# EasyEDA Pro project 3020包裹款控制板 -0113.eprj, board PCB
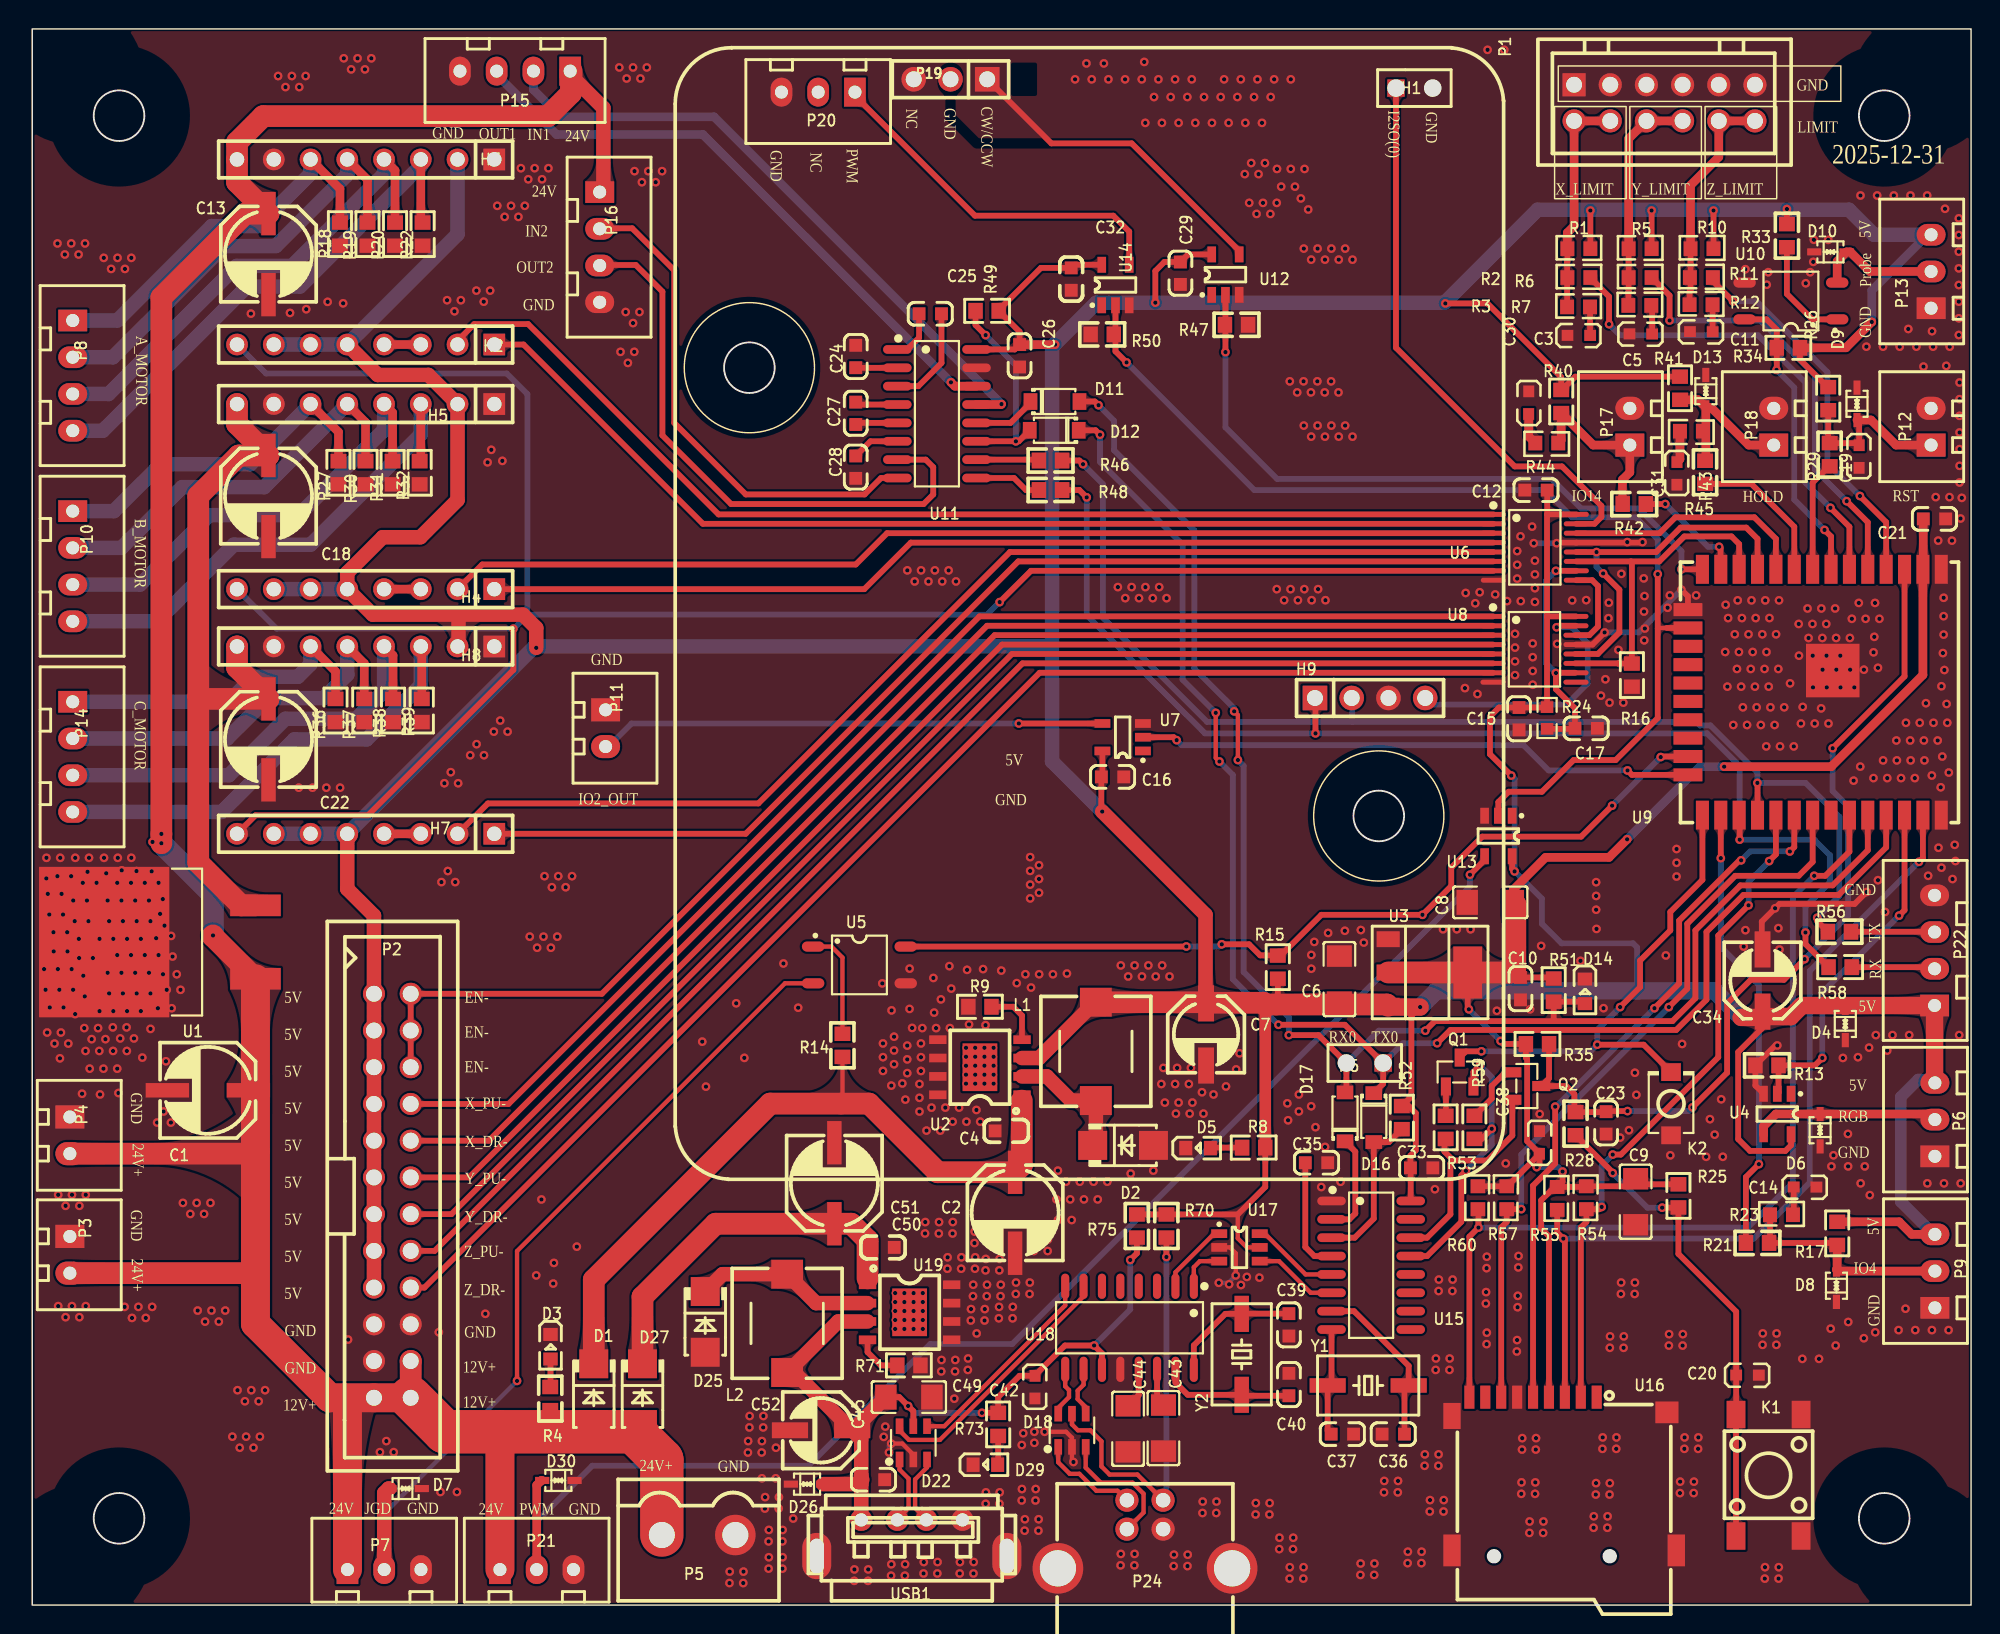
[diagram p2: board, top side]
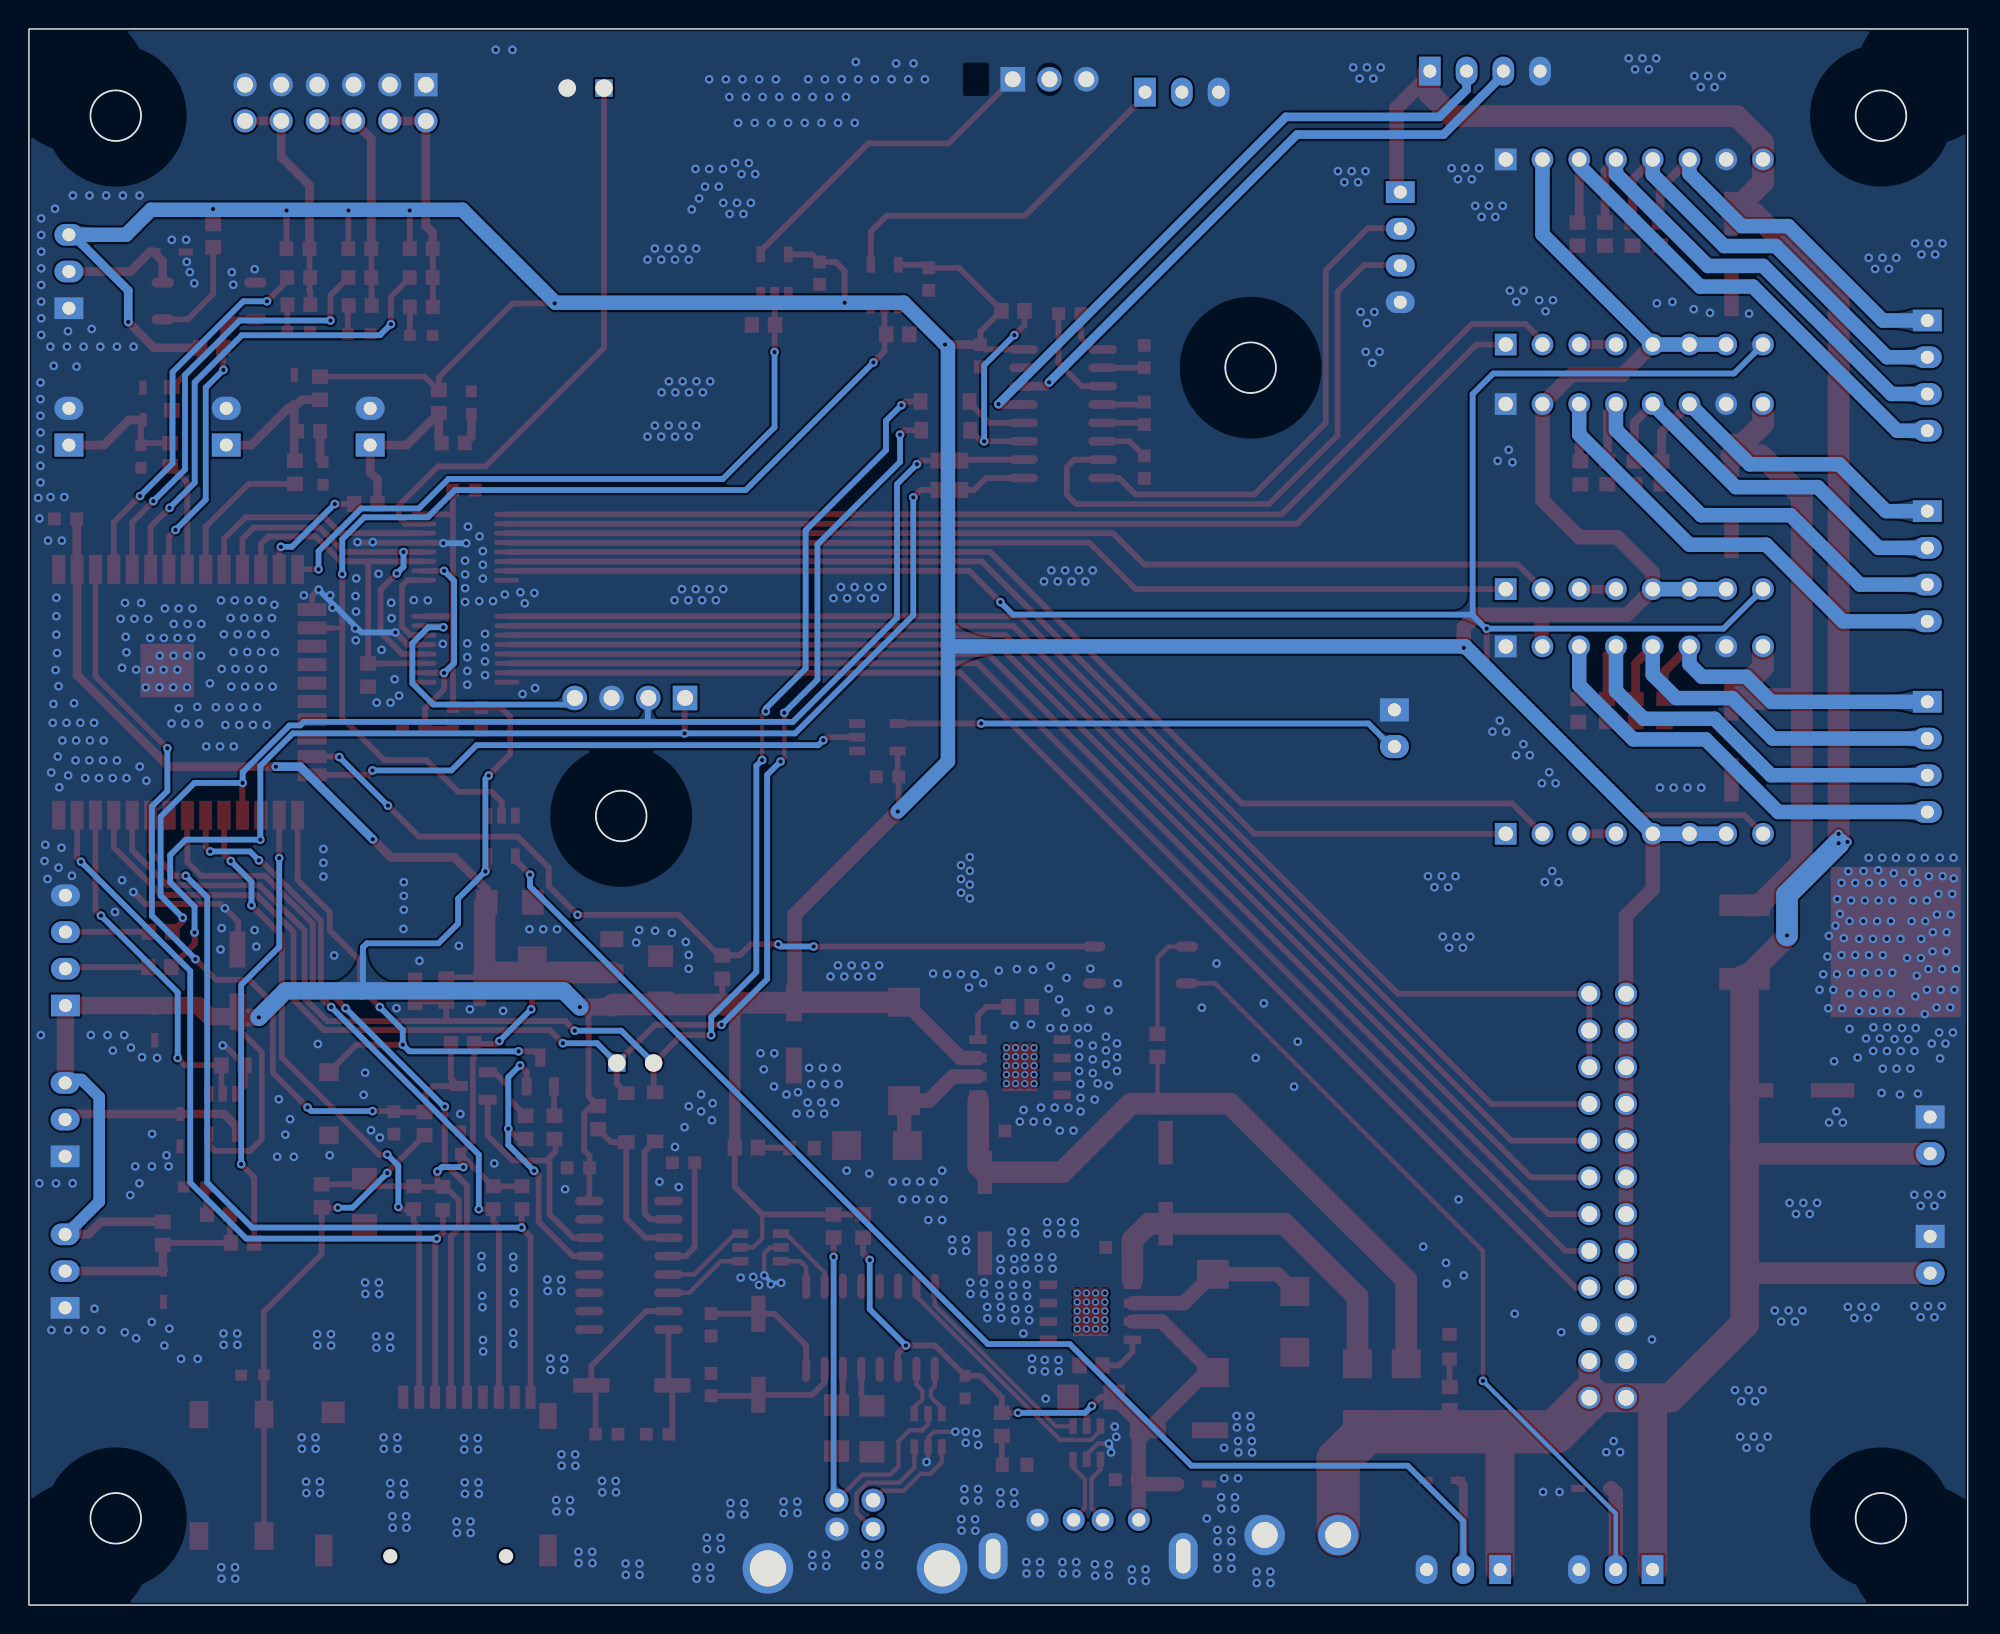
[diagram p3: board, bottom side, seen from below]

Outline 134 x 109 mm; copper layers: Top Layer, Bottom Layer. Coordinates in mm from the lower left corner of the outline.
Outline path: rectangle 0,109 134,0 ; circle c6,103 r1.75 ; circle c6,6 r1.75 ; circle c49.56,85.57 r1.75 ; circle c93.06,54.57 r1.75 ; circle c128,103 r1.75 ; circle c128,6 r1.75
Stack: Top Layer 0.035mm / Dielectric1 1.51mm FR4 er 4.5 / Bottom Layer 0.035mm

## Design rules (mm)
net USB_DP: DP1
net USB_DM: DP1
net DP: DP2
net DM: DP2
net D1-: DP3
net D1+: DP3
template: 用户自定义配置
spacing Default (default): track to track 0.152, other pairs 0 to 0.152
track width Default (default): min 0.254, default 0.254, max 25.4
differential pair differentialPair (default): width min 0.127, default 0.254, max 2.54; gap min 0.152, default 0.152
via Default (default): diameter min 0.25, default 0.61, max 100.025; hole min 0.2, default 0.305, max 59.995

## Placement (name value [footprint] x y rotation side)
C1  100uF/35V  [电解电容贴片6X6]  12.14 35.6 180 top
C2  100uF/35V  [电解电容贴片6X6]  67.93 27.13 270 top
C3  103  [11]  107.63 87.51 0 top
C4  104  [0603C]  67.32 32.79 0 top
C5  103  [11]  111.92 87.61 0 top
C6  10uF  [C1206]  90.34 43.29 90 top
C7  100uF/10V  [CAP-SMD_BD5.0-L5.3-W5.3-RD]  81.13 39.46 90 top
C8  4.7uF  [C1206]  100.77 48.6 0 top
C9  4.7uF  [C1206]  110.82 27.89 90 top
C10  104  [0603C]  102.86 42.63 90 top
C11  103  [11]  116.1 87.76 0 top
C12  104  [0603C]  103.93 77.11 180 top
C13  100uF/35V  [电解电容贴片6X6]  16.33 93.43 270 top
C14  103  [11]  123.27 28.61 0 top
C15  104  [0603C]  102.76 61.3 270 top
C16  104  [0603C]  74.66 57.27 180 top
C17  104  [0603C]  107.4 60.63 180 top
C18  100uF/35V  [电解电容贴片6X6]  16.33 76.7 270 top
C19  103  [11]  125.96 78.69 270 top
C20  103  [11]  119.29 15.61 0 top
C21  104  [0603C]  131.47 75.12 0 top
C22  100uF/35V(47uF/50V)  [电解电容贴片6X6]  16.33 59.87 270 top
C23  104  [0603C]  108.78 33.35 90 top
C24  104  [0603C]  56.92 86.34 270 top
C25  104  [0603C]  62.07 89.3 180 top
C26  104  [0603C]  68.24 86.4 90 top
C27  104  [0603C]  56.92 82.42 90 top
C28  104  [0603C]  56.92 78.69 270 top
C29  104  [0603C]  79.36 92.11 90 top
C30  103  [11]  103.72 83.89 90 top
C31  103  [11]  113.37 77.52 270 top
C32  104  [0603C]  71.81 91.7 90 top
C33  104  [0603C]  96.03 30.24 0 top
C34  100uF/10V  [CAP-SMD_BD5.0-L5.3-W5.3-RD]  119.59 43.19 270 top
C35  104  [0603C]  88.76 30.59 0 top
C36  18pF  [0603C]  94.07 11.82 180 top
C37  18pF  [0603C]  90.55 11.82 0 top
C38  104  [11]  104.47 32.73 90 top
C39  18pF  [0603C]  86.85 19.38 90 top
C40  18pF  [0603C]  86.85 15.25 270 top
C42  103  [11]  69 14.33 270 top
C43  10uF  [C1206]  78.18 12.24 270 top
C44  10uF  [C1206]  75.74 12.19 270 top
C45  18pF  [0603C]  58.14 8.67 180 top
C49  10uF  [C1206]  60.59 14.38 0 top
C50  104  [0603C]  58.8 24.74 180 top
C51  100uF/35V  [电解电容贴片6X6]  55.44 29.17 90 top
C52  100uF/10V  [CAP-SMD_BD5.0-L5.3-W5.3-RD]  54.52 12.09 0 top
D1  SS56  [SMA]  38.81 14.59 270 top
D2  SS34  [SMA]  75.39 31.79 0 top
D3  绿光  [0603LED]  35.8 17.9 90 top
D4  PESD5V0L1BA-N  [SOD-323_L1.8-W1.3-LS2.5-BI]  125.31 40.19 90 top
D5  绿光  [0603LED]  80.54 31.59 180 top
D6  PESD5V0L1BA-N  [SOD-323_L1.8-W1.3-LS2.5-BI]  123.57 32.84 90 top
D7  PESD5V0L1BA-N  [SOD-323_L1.8-W1.3-LS2.5-BI]  25.81 8.06 180 top
D8  PESD5V0L1BA-N  [SOD-323_L1.8-W1.3-LS2.5-BI]  124.7 22.08 90 top
D9  PESD5V0L1BA-N  [SOD-323_L1.8-W1.3-LS2.5-BI]  126.12 83.07 270 top
D10  PESD5V0L1BA-N  [SOD-323_L1.8-W1.3-LS2.5-BI]  124.28 93.58 0 top
D11  1N4148  [SOD-123_L2.8-W1.8-LS3.7-RD]  70.69 83.23 0 top
D12  1N4148  [SOD-123_L2.8-W1.8-LS3.7-RD]  70.64 81.24 180 top
D13  PESD5V0L1BA-N  [SOD-323_L1.8-W1.3-LS2.5-BI]  115.67 83.95 270 top
D14  绿光  [0603LED]  107.3 42.48 90 top
D16  1N4148  [SOD-123_L2.8-W1.8-LS3.7-RD]  92.72 33.71 270 top
D17  1N4148  [SOD-123_L2.8-W1.8-LS3.7-RD]  90.73 33.76 90 top
D18  USBLC6-2SC6  [SOT-23-6_L2.9-W1.6-P0.95-LS2.8-BL]  71.86 12.09 0 top
D22  USBLC6-2SC6  [SOT-23-6_L2.9-W1.6-P0.95-LS2.8-BL]  60.9 11.22 0 top
D25  SS34  [SMA]  46.51 19.58 270 top
D26  PESD5V0L1BA-N  [SOD-323_L1.8-W1.3-LS2.5-BI]  53.55 8.36 0 top
D27  SS56  [SMA]  42.18 14.59 270 top
D29  绿光  [0603LED]  65.84 9.69 180 top
D30  PESD5V0L1BA-N  [SOD-323_L1.8-W1.3-LS2.5-BI]  36.36 8.62 180 top
H1  PZ254  [HDR-TH_2P-P2.54-V-M]  95.52 104.91 0 top
H2  PZ254V-11-08P  [HDR-TH_8P-P2.54-V-M]  23.04 87.17 180 top
H3  PZ254V-11-08P  [HDR-TH_8P-P2.54-V-M]  23.04 99.97 180 top
H4  PZ254V-11-08P  [HDR-TH_8P-P2.54-V-M]  23.04 70.26 180 top
H5  PZ254V-11-08P  [HDR-TH_8P-P2.54-V-M]  23.04 83.06 180 top
H6  PZ254V-11-02P  [HDR-TH_2P-P2.54-V-M]  92.1 37.49 180 top
H7  PZ254V-11-08P  [HDR-TH_8P-P2.54-V-M]  23.04 53.34 180 top
H8  PZ254V-11-08P  [HDR-TH_8P-P2.54-V-M]  23.04 66.3 180 top
H9  PZ254V-11-04P  [HDR-TH_4P-P2.54-V-M]  92.46 62.73 0 top
K1  SW_6X6_H=12.0MM  [KEY-SMD_4P-L6.0-W6.0-P4.50-LS9.0]  120 8.98 270 top
K2  TS-1088  [SW-SMD_L3.9-W3.0-P4.45]  113.26 34.67 90 top
L1  68uH  [IND-SMD_L7.0-W7.0_SMDRI74-330MT]  73.51 38.29 270 top
L2  68uH  [IND-SMD_L7.0-W7.0_SMDRI74-330MT]  52.17 19.48 90 top
P1  XHD2.54-2x6A  [CONN-TH_12P-P2.50_HC-XHD2.54-2X6A]  112.81 103.89 180 top
P2  XHD2.54-2*12  [IDC-TH_24P-P2.54-V-R2-C12-S2.54]  24.89 28.31 270 top
P3  2P  [HDR1X2_CON]  2.6 24.23 270 top
P4  2P  [HDR1X2_CON]  2.6 32.49 270 top
P5  KF2EDGVC-5.08-2P  [CONN-TH_P5.08_KF2EDGVC-5.08-2P]  46.05 4.85 0 top
P6  3P  [HDR1X3_CON]  131.5 33.57 90 top
P7  3P  [HDR1X3_CON]  24.33 2.46 0 top
P8  4P  [HDR1X4_CON]  2.8 88.84 270 top
P9  3P  [HDR1X3_CON]  131.5 23.1 90 top
P10  4P  [HDR1X4_CON]  2.8 75.65 270 top
P11  2P  [HDR1X2_CON]  39.63 60.64 270 top
P12  2P  [HDR1X2_CON]  131.24 81.49 90 top
P13  3P  [HDR1X3_CON]  131.24 92.23 90 top
P14  4P  [HDR1X4_CON]  2.8 62.47 270 top
P15  4P  [HDR1X4_CON]  37.18 106.08 180 top
P16  4P  [HDR1X4_CON]  39.22 97.72 270 top
P17  2P  [HDR1X2_CON]  110.42 81.49 90 top
P18  2P  [HDR1X2_CON]  120.36 81.49 90 top
P19  PZ254V-11-03P  [HDR-TH_3P-P2.54-V-M]  63.47 105.52 180 top
P20  3P  [HDR1X3_CON]  54.32 104.63 180 top
P21  3P  [HDR1X3_CON]  34.87 2.46 0 top
P22  4P  [HDR1X4_CON]  131.48 41.46 90 top
P24  USB-B10-BRW  [USB-B-TH_USB-B10-BRW]  76.91 4.9 0 top
Q1  SS8050  [SOT-23-3_L2.9-W1.3-P1.90-LS2.4-BR]  98.66 36.86 270 top
Q2  SS8050  [SOT-23-3_L2.9-W1.3-P1.90-LS2.4-BR]  103.3 35.89 180 top
R1  51K  [10]  106 93.68 0 top
R2  100  [10]  106 91.69 0 top
R3  100  [10]  105.98 89.66 0 top
R4  47K  [0603R]  35.8 14.28 270 top
R5  51K  [10]  110.23 93.68 0 top
R6  100  [10]  110.23 91.69 0 top
R7  100  [10]  110.21 89.76 0 top
R8  10K  [0603R]  84.42 31.64 0 top
R9  10K  [0603R]  65.5 41.38 180 top
R10  51K  [10]  114.51 93.68 0 top
R11  100  [10]  114.47 91.69 0 top
R12  100  [10]  114.45 89.81 0 top
R13  10K  [0603R]  119.9 37.33 180 top
R14  22K  [0603R]  56 38.71 90 top
R15  10K  [0603R]  86.09 44.12 90 top
R16  10K  [0603R]  110.56 64.31 270 top
R17  10K  [0603R]  124.75 25.7 270 top
R18  10K  [0603R]  21.27 94.81 270 top
R19  10K  [0603R]  23.17 94.81 270 top
R20  10K  [0603R]  25.08 94.81 270 top
R21  100  [0603R]  119.24 25.04 0 top
R22  10K  [0603R]  26.98 94.81 270 top
R23  100  [10]  120 26.88 0 top
R24  10kΩ  [R0603]  104.7 61.35 90 top
R25  10K  [0603R]  113.77 28.3 270 top
R26  10K  [0603R]  124.13 83.43 270 top
R27  10K  [0603R]  21.17 78.3 270 top
R28  100  [0603R]  106.66 33.29 270 top
R29  100  [0603R]  124.23 79.55 90 top
R30  10K  [0603R]  23.04 78.3 270 top
R31  10K  [0603R]  24.91 78.3 270 top
R32  10K  [0603R]  26.78 78.3 270 top
R33  1K  [0603R]  121.27 94.7 270 top
R34  10K  [0603R]  121.37 86.95 180 top
R35  10K  [0603R]  104.03 38.8 0 top
R36  10K  [0603R]  20.96 61.86 270 top
R37  10K  [0603R]  22.95 61.86 270 top
R38  10K  [0603R]  24.94 61.86 270 top
R39  10K  [0603R]  26.92 61.86 270 top
R40  10K  [0603R]  105.67 83.23 270 top
R41  10K  [0603R]  113.88 84.15 270 top
R42  100  [0603R]  110.72 76.14 180 top
R43  100  [0603R]  115.62 78.34 90 top
R44  100  [10]  105.57 80.48 180 top
R45  100  [10]  115.57 81.3 180 top
R46  0Ω  [0603R]  70.38 79.15 0 top
R47  100  [0603R]  83.23 88.54 0 top
R48  0Ω  [0603R]  70.38 77.11 0 top
R49  10K  [0603R]  66 89.51 180 top
R50  10K  [0603R]  73.95 87.87 180 top
R51  10K  [0603R]  105.16 42.53 90 top
R52  10K  [0603R]  94.66 33.71 270 top
R53  10K  [0603R]  97.69 33.04 90 top
R54  10K  [10]  107.53 27.28 90 top
R55  10K  [10]  105.51 27.23 90 top
R56  100Ω  [0603R]  124.9 46.56 0 top
R57  10K  [10]  102.02 27.28 90 top
R58  100Ω  [0603R]  124.95 44.12 0 top
R59  10K  [0603R]  99.68 33.04 90 top
R60  10K  [10]  100.03 27.28 90 top
R70  0Ω  [0603R]  78.39 26.21 90 top
R71  10K  [0603R]  60.59 16.58 0 top
R73  10K  [0603R]  66.76 12.5 90 top
R75  0Ω  [0603R]  76.35 26.21 90 top
U1  CJ7812  [TO-263-2_L10.1-W9.1-P5.08-LS15.2-TL]  10.2 45.85 180 top
U2  XL1509-5.0E1//SXL1509-5.0E1  [ESOP-8_L4.9-W3.9-P1.27-LS6.0-BL-EP]  65.5 37.2 90 top
U3  1117-3.3  [SOT-223]  96.41 43.75 270 top
U4  74LVC1G17  [SOT-23-5]  120.61 33.96 270 top
U5  LTV-357T-C  [SOP-4_L4.4-W3.9-P2.54-LS7.0-TL]  57.17 44.27 0 top
U6  74AHCT595T16-13  [TSSOP-16_L5.0-W4.4-P0.65-LS6.4-BL]  103.85 73.15 270 top
U7  74LVC1G17  [SOT-23-5]  75.37 60.02 180 top
U8  74AHCT595T16-13  [TSSOP-16_L5.0-W4.4-P0.65-LS6.4-BL]  103.83 66.1 270 top
U9  ESP32-WROOM-32  [WIFI-SMD_ESP32-WROOM-32UE-A]  123.19 63.13 270 top
U10  LTV-357T-C  [SOP-4_L4.4-W3.9-P2.54-LS7.0-TL]  121.55 90.19 180 top
U11  SP3232EEN-L/TR  [SOIC-16_L9.9-W3.9-P1.27-LS6.0-BL]  62.53 82.39 270 top
U12  74LVC1G17  [SOT-23-5]  82.47 92.01 90 top
U13  74LVC1G17  [SOT-23-5]  101.33 53.19 270 top
U14  74LVC1G17  [SOT-23-5]  74.87 91.29 90 top
U15  CH340G  [SOIC-16_L9.9-W3.9-P1.27-LS6.0-BL]  92.54 23.5 270 top
U16  自弹TF卡座TFAA  [SIM-SMD_C9900015645]  105.88 9.08 0 top
U17  USBLC2-2SC6  [SOT-23-6]  83.44 24.74 0 top
U18  SL2.1A  [SOP-16_L10.0-W3.9-P1.27-LS6.0-BL]  75.84 19.18 180 top
U19  XL1509-5.0E1//SXL1509-5.0E1  [ESOP-8_L4.9-W3.9-P1.27-LS6.0-BL-EP]  60.64 20.25 270 top
USB1  U-USBAS04P-F001  [USB-A-TH_USB-M-22]  60.79 4.64 0 top
Y1  12M  [晶振贴片49SSMD]  92.33 15.19 0 top
Y2  12M  [晶振贴片49SSMD]  83.59 17.34 90 top

## Footprints (pads in the part's own frame, mm; a bottom-side part is the same pattern mirrored in y, then rotated)
10
  rect 0.965x1.016 smd: 1(0.101,0.117) 2(1.688,0.117)
11
  rect 0.813x0.762 smd: 1(0.043,0.296) 2(-1.524,0.301)
0603C
  rect 0.889x0.889 smd: 1(-0.774,0) 2(0.774,0)
0603LED
  rect 0.9x1 smd: 1(-0.884,-0.017) 2(0.816,-0.017)
0603R
  rect 1x1.1 smd: 1(-0.8,0) 2(0.8,0)
C1206
  rect 1.485x1.728 smd: 1(-1.593,0) 2(1.593,0)
CAP-SMD_BD5.0-L5.3-W5.3-RD
  rect 2.5x1.1 smd: 1(2.15,0) 2(-2.15,0)
CONN-TH_12P-P2.50_HC-XHD2.54-2X6A
  rect 1.6x1.6 hole 1.1: 1(6.25,-1.25)
  round 1.6 hole 1.1: 2(6.25,1.25) 3(3.75,-1.25) 4(3.75,1.25) 5(1.25,-1.25) 6(1.25,1.25) 7(-1.25,-1.25) 8(-1.25,1.25) 9(-3.75,-1.25) 10(-3.75,1.25) 11(-6.25,-1.25) 12(-6.25,1.25)
CONN-TH_P5.08_KF2EDGVC-5.08-2P
  round 2.8 hole 1.8: 1(-2.54,0) 2(2.54,0)
ESOP-8_L4.9-W3.9-P1.27-LS6.0-BL-EP
  rect 0.6x1.2 smd: 1(-1.905,-2.909) 2(-0.635,-2.909) 3(0.635,-2.909) 4(1.905,-2.909) 5(1.905,2.909) 6(0.635,2.909) 7(-0.635,2.909) 8(-1.905,2.909)
  rect 3.3x2.4 smd: 9(0,0)
HDR1X2_CON
  rect 1.6x2 hole 0.9: 1(-1.27,0)
  oval 1.6x2 hole 0.9: 2(1.27,0)
HDR1X3_CON
  rect 1.5x2 hole 0.9: 1(-2.54,0)
  oval 1.5x2 hole 0.9: 2(0,0) 3(2.54,0)
HDR1X4_CON
  rect 1.5x2 hole 0.9: 1(0,0)
  oval 1.5x2 hole 0.9: 2(2.54,0) 3(5.08,0) 4(7.62,0)
HDR-TH_2P-P2.54-V-M
  rect 1.2x1.2 hole 1.2x0.8: 1(-1.27,0)
  round 1.2 hole 1.2x0.8: 2(1.27,0)
HDR-TH_3P-P2.54-V-M
  rect 1.7x1.7 hole 1.1: 1(-2.54,0)
  round 1.7 hole 1.1: 2(0,0) 3(2.54,0)
HDR-TH_4P-P2.54-V-M
  rect 1.7x1.7 hole 1.1: 1(-3.81,0)
  round 1.7 hole 1.1: 2(-1.27,0) 3(1.27,0) 4(3.81,0)
HDR-TH_8P-P2.54-V-M
  rect 1.5x1.5 hole 1: 1(-8.89,0)
  round 1.5 hole 1: 2(-6.35,0) 3(-3.81,0) 4(-1.27,0) 5(1.27,0) 6(3.81,0) 7(6.35,0) 8(8.89,0)
IDC-TH_24P-P2.54-V-R2-C12-S2.54
  round 1.524 hole 1.1: 1(-13.97,-1.27) 2(-13.97,1.27) 3(-11.43,-1.27) 4(-11.43,1.27) 5(-8.89,-1.27) 6(-8.89,1.27) 7(-6.35,-1.27) 8(-6.35,1.27) 9(-3.81,-1.27) 10(-3.81,1.27) 11(-1.27,-1.27) 12(-1.27,1.27) 13(1.27,-1.27) 14(1.27,1.27) 15(3.81,-1.27) 16(3.81,1.27) 17(6.35,-1.27) 18(6.35,1.27) 19(8.89,-1.27) 20(8.89,1.27) 21(11.43,-1.27) 22(11.43,1.27) 23(13.97,-1.27) 24(13.97,1.27)
IND-SMD_L7.0-W7.0_SMDRI74-330MT
  rect 2x2.2 smd: 1(-3.4,0) 2(3.4,0)
KEY-SMD_4P-L6.0-W6.0-P4.50-LS9.0
  rect 1.9x1.3 smd: 1(-4.2,2.25) 2(4.2,2.25) 3(-4.2,-2.25) 4(4.2,-2.25)
R0603
  rect 0.806x0.864 smd: 1(-0.753,0) 2(0.753,0)
SIM-SMD_C9900015645
  rect 0.7x1.6 smd: 1(2.25,5.3) 2(1.15,5.3) 3(0.05,5.3) 4(-1.05,5.3) 5(-2.15,5.3) 6(-3.25,5.3) 7(-4.35,5.3) 8(-5.45,5.3) 9(-6.55,5.3)
  rect 1.2x1.8 smd: 10(-7.75,4)
  rect 1.6x1.5 smd: 11(7.1,4.25)
  rect 1.2x2.2 smd: 12(-7.75,-5.3) 13(7.75,-5.3)
SMA
  rect 2x2 smd: 1(2.1,0) 2(-2.1,0)
SOD-123_L2.8-W1.8-LS3.7-RD
  rect 0.95x1.15 smd: 1(-1.692,0) 2(1.692,0)
SOD-323_L1.8-W1.3-LS2.5-BI
  rect 0.986x0.49 smd: 1(-1.117,0) 2(1.117,0)
SOIC-16_L9.9-W3.9-P1.27-LS6.0-BL
  oval 0.602x1.971 smd: 1(-4.445,-2.736) 2(-3.175,-2.736) 3(-1.905,-2.736) 4(-0.635,-2.736) 5(0.635,-2.736) 6(1.905,-2.736) 7(3.175,-2.736) 8(4.445,-2.736) 9(4.445,2.736) 10(3.175,2.736) 11(1.905,2.736) 12(0.635,2.736) 13(-0.635,2.736) 14(-1.905,2.736) 15(-3.175,2.736) 16(-4.445,2.736)
SOP-4_L4.4-W3.9-P2.54-LS7.0-TL
  oval 1.55x0.7 smd: 1(-3.2,1.27) 2(-3.2,-1.27) 3(3.2,-1.27) 4(3.2,1.27)
SOP-16_L10.0-W3.9-P1.27-LS6.0-BL
  oval 0.56x1.745 smd: 1(-4.445,-2.873) 2(-3.175,-2.873) 3(-1.905,-2.873) 4(-0.635,-2.873) 5(0.635,-2.873) 6(1.905,-2.873) 7(3.175,-2.873) 8(4.445,-2.873) 9(4.445,2.873) 10(3.175,2.873) 11(1.905,2.873) 12(0.635,2.873) 13(-0.635,2.873) 14(-1.905,2.873) 15(-3.175,2.873) 16(-4.445,2.873)
SOT-23-3_L2.9-W1.3-P1.90-LS2.4-BR
  rect 1.25x0.7 smd: 1(1,-0.95) 2(1,0.95) 3(-1,0)
SOT-23-5
  rect 1.1x0.6 smd: 1(-1.4,0.95) 2(-1.4,0) 3(-1.4,-0.95) 4(1.4,-0.95) 5(1.4,0.95)
SOT-23-6
  rect 1.1x0.6 smd: 1(-1.4,0.95) 2(-1.4,0) 3(-1.4,-0.95) 4(1.4,-0.95) 5(1.4,0) 6(1.4,0.95)
SOT-23-6_L2.9-W1.6-P0.95-LS2.8-BL
  rect 0.532x1.072 smd: 1(-0.95,-1.149) 2(0,-1.149) 3(0.95,-1.149) 4(0.95,1.149) 5(0,1.149) 6(-0.95,1.149)
SOT-223
  rect 1.1x1.6 smd: 1(-2.3,-2.7) 2(0,-2.7) 3(2.3,-2.7)
  rect 3.6x2 smd: 4(0,2.8)
SW-SMD_L3.9-W3.0-P4.45
  rect 1.23x1.36 smd: 1(-2.185,0) 2(2.185,0)
TO-263-2_L10.1-W9.1-P5.08-LS15.2-TL
  rect 3.5x1.5 smd: 1(-5.228,2.54) 3(-5.228,-2.54)
  rect 9x10.4 smd: 2(5.228,0)
TSSOP-16_L5.0-W4.4-P0.65-LS6.4-BL
  oval 0.343x1.732 smd: 1(-2.275,-2.866) 2(-1.625,-2.866) 3(-0.975,-2.866) 4(-0.325,-2.866) 5(0.325,-2.866) 6(0.975,-2.866) 7(1.625,-2.866) 8(2.275,-2.866) 9(2.275,2.866) 10(1.625,2.866) 11(0.975,2.866) 12(0.325,2.866) 13(-0.325,2.866) 14(-0.975,2.866) 15(-1.625,2.866) 16(-2.275,2.866)
USB-A-TH_USB-M-22
  oval 2x3.2 hole 1x2.4: 0(-6.57,-1.25) 0(6.57,-1.25)
  round 1.524 hole 0.914: 1(-3.5,1.25) 2(-1.001,1.25) 3(1.001,1.25) 4(3.5,1.25)
USB-B-TH_USB-B10-BRW
  round 1.6 hole 1: 1(1.25,2.355) 2(-1.25,2.355) 3(-1.25,0.355) 4(1.25,0.355)
  round 3.5 hole 2.5: 5(-6.02,-2.355) 6(6.02,-2.355)
WIFI-SMD_ESP32-WROOM-32UE-A
  rect 2x0.9 smd: 1(-8.5,8.755) 2(-8.5,7.485) 3(-8.5,6.215) 4(-8.5,4.945) 5(-8.5,3.675) 6(-8.5,2.405) 7(-8.5,1.135) 8(-8.5,-0.135) 9(-8.5,-1.405) 10(-8.5,-2.675) 11(-8.5,-3.945) 12(-8.5,-5.215) 13(-8.5,-6.485) 14(-8.5,-7.755) 25(8.5,-7.755) 26(8.5,-6.485) 27(8.5,-5.215) 28(8.5,-3.945) 29(8.5,-2.675) 30(8.5,-1.405) 31(8.5,-0.135) 32(8.5,1.135) 33(8.5,2.405) 34(8.5,3.675) 35(8.5,4.945) 36(8.5,6.215) 37(8.5,7.485) 38(8.5,8.755)
  rect 0.9x2 smd: 15(-5.715,-8.755) 16(-4.445,-8.755) 17(-3.175,-8.755) 18(-1.905,-8.755) 19(-0.635,-8.755) 20(0.635,-8.755) 21(1.905,-8.755) 22(3.175,-8.755) 23(4.445,-8.755) 24(5.715,-8.755)
  rect 3.7x3.7 smd: 39(-1.5,1.255)
晶振贴片49SSMD
  rect 2.5x1 smd: 1(-2.8,0) 2(2.8,0)
电解电容贴片6X6
  rect 3x1 smd: 1(-2.8,0) 2(2.8,0)

## Nets
As in the schematic.

Pads without a net: P19 3; P20 2; U2 9; U4 1; U7 1; U8 9; U9 17 18 19 20 21 22 32; U12 1; U13 1; U14 1; U15 9 10 11 12 15; U16 1 8; U19 9

## Via types
v1: diameter 0.5, hole 0.3, Top Layer to Bottom Layer, 40 vias
v2: diameter 0.6, hole 0.3, Top Layer to Bottom Layer, 1088 vias

## Routing (per net, layer and track width the routed paths; a pad name or vN(x,y) marks a point on that pad's centre or on a via; arc(x,y) is an arc through that point)
3V3: length 110.9
  Top Layer w0.4: 104.17,31.18 101.95,28.96 R57.2 R60.2 ; 104.17,31.18 C38.2 104.17,31.23 103.32,32.08 103.32,37.77 103.23,37.85 R35.1 101.69,38.8 v2(101.48,39.01) ; 104.17,31.18 104.17,30.47 v2(103.98,30.29) ; R25.1 111.2,29.1 C9.2 110.3,28.96 R54.2 107.37,28.92 R55.2 ; 102.86,43.4 105.08,43.4 R51.2 ; v2(105.77,29.98) 105.77,29.29 R55.2 ; R55.2 105.21,28.92 104.29,27.99 104.29,26.05 104.83,25.52 104.83,14.38 ; v2(99.29,41.2) 99.21,41.28 U3.4
  Top Layer w0.6: v2(110.23,52.96) 108.98,51.71 104.59,51.71 102.36,49.48 C8.2 ; 130.7,75.12 130.7,71.65 U9.2 130.67,64.32 124.33,57.98 v2(116.94,57.98)
  Top Layer w1.5: C8.2 102.5,48.46 102.5,44.06 102.18,43.74 ; 102.18,43.75 U3.4 U3.2
  Bottom Layer w0.4: v2(103.98,30.29) 105.46,30.29 v2(105.77,29.98) ; v2(101.48,39.01) v2(99.29,41.2)
  Bottom Layer w0.6: v2(116.94,57.98) 115.25,57.98 v2(110.23,52.96)
5V_2: length 55.3
  Top Layer w0.4: v2(65.64,13.3) R73.2 66.76,14.38 68.23,15.86 C42.2 69.31,15.88 71.38,17.95 v2(73.39,17.95) 73.93,17.41 U18.11 ; C49.1 59.93,14.38 v2(60.54,13.77) 60.9,13.41 D22.5 ; R75.1 76.35,24.33 v2(75.89,23.87)
  Top Layer w1: 57.29,8.6 57.06,8.36 D26.2 ; 57.29,8.6 USB1.1 ; 57.29,8.6 C45.2 ; 57.29,8.6 57.29,11.46 C52.1 ; C52.1 56.7,12.09 C49.1 ; C52.1 52.67,16.08 L2.1 55.7,19.61 U19.3
  Bottom Layer w0.4: v2(65.64,13.3) 61.01,13.3 v2(60.54,13.77) ; v2(75.89,23.87) 75.89,20.45 v2(73.39,17.95)
5V_VCC: length 549
  Top Layer w0.3: 83.32,27.01 83.32,25.36 83.95,24.74 U17.5
  Top Layer w0.4: v2(95.92,41.35) 95.32,40.75 95.32,35.17 R52.1 95.13,34.51 95.63,34.02 95.63,31.46 95.25,31.08 C33.1 95.27,30.22 U15.16 ; R10.2 v2(116.2,96.44) ; C12.1 104.71,75.43 ; 104.71,75.43 104.71,75.43 106.72,75.43 ; 104.71,75.43 104.7,75.42 104.7,68.34 ; v2(102.45,50.74) 102.28,50.91 U13.5 ; 85.97,41.53 86.09,41.65 R15.1 ; U14.5 72.02,92.69 C32.2 69.71,92.47 66.79,89.56 R49.1 68.24,88.06 C26.2 67.9,86.83 U11.16 ; 119.54,40.7 119.54,39.88 117.91,38.24 117.91,32.23 118.72,31.41 121.17,31.41 121.56,31.8 U4.5 ; 104.7,68.34 104.7,62.1 104.67,62.07 101.37,62.07 100.75,61.45 100.75,58.84 v2(102.23,57.37) ; 104.7,68.34 104.73,68.37 U8.16 ; 73.89,54.94 C16.2 73.97,57.35 U7.5 ; R34.1 122.17,86.13 124.08,84.23 R26.1 ; 85.22,31.59 85.22,28.92 83.32,27.01 R70.2 R75.2 ; U12.5 79.88,93.41 C29.2 78.24,92.88 77.62,92.26 v2(77.62,90.07) ; R1.2 v2(107.69,96.44) ; R41.1 106.64,84.95 105.72,84.03 R40.1 105.67,84.92 100.57,90.02 v2(97.67,90.02) ; R33.1 v2(121.27,96.54) ; 111.92,93.8 v2(111.92,96.44)
  Top Layer w0.6: R34.1 125.35,86.95 v2(127.14,88.73) ; R17.1 129.03,26.5 129.9,25.64 P9.3 ; C26.2 v2(70.69,87.17)
  Top Layer w0.8: 85.22,41.39 R8.2
  Top Layer w1: v2(34.83,66.2) 34.83,67.58 33.92,68.49 29.46,68.49 ; H2.5 23.88,85.07 27.38,85.07 H5.2 29.39,76.42 26.83,73.85 24.23,73.85 21.77,71.4 H4.5 23.54,68.49 29.46,68.49 ; H8.2 29.46,66.36 29.46,68.49 ; P2.17 P2.15 P2.13 P2.11 P2.9 P2.7 P2.5 P2.3 P2.1 23.62,47.68 21.77,49.52 H7.5 ; U2.3 69.59,37.83 73.45,41.69 ; 81.13,41.69 C7.1 ; 81.09,41.73 81.09,47.74 v2(73.95,54.88)
  Top Layer w1.2: v2(118.11,40.64) 119.48,40.64 119.54,40.7 121.54,40.7 122.31,41.46 P22.1 131.48,36.14 P6.3 ; 93.81,41.35 v2(95.92,41.35)
  Top Layer w1.5: L1.1 81.23,41.69 81.27,41.65 85.07,41.65 85.28,41.45 85.36,41.53 93.63,41.53 U3.3
  Bottom Layer w0.4: 110.98,42.48 110.92,42.53 110.92,45.49 110.64,45.76 105.69,45.76 104.34,47.12 104.34,48.85 v2(102.45,50.74) 102.45,57.14 v2(102.23,57.37)
  Bottom Layer w0.6: 130.99,94.77 127.14,90.91 v2(127.14,88.73)
  Bottom Layer w0.8: 131.5,25.79 131.25,25.79 129.14,27.9 129.14,35.13 130.35,36.34 131.5,36.34
  Bottom Layer w1: 70.48,66.35 70.48,87.01 73.54,90.07 v2(77.62,90.07) 97.62,90.07 104.04,96.49 125.56,96.49 127.29,94.77 P13.3 ; 70.48,66.35 70.44,66.3 34.74,66.3 H7.5 H7.6 H7.7 ; 70.48,66.35 70.48,58.35 v2(73.95,54.88) ; H2.7 H2.6 H2.5 29.39,94.79 H3.2 ; H4.5 H4.6 H4.7
  Bottom Layer w1.2: v2(118.11,40.64) 116.27,42.48 97.05,42.48 v2(95.92,41.35)
12V: length 210.6
  Top Layer w1: 37.18,105.83 39.47,103.54 39.47,97.75
  Top Layer w1.5: 15.05,22.85 14.94,22.96 P3.2 ; U1.1 12.5,46.24 v2(12.5,46.31) ; P4.2 15.26,31.22 15.43,31.38 ; v2(8.92,52.68) v2(8.92,53.33) 8.92,90.42 14.73,96.23 C13.1 14.15,98.4 H3.8 14.15,101.16 15.96,102.97 35.65,102.97 37.23,104.55 37.23,105.78 ; P2.22 P2.24
  Top Layer w1.6: 37.23,105.78 37.23,106.08
  Top Layer w2: P7.1 21.79,13.91 21.68,14.03 ; P2.24 P2.23 20.55,14.34 15.43,19.46 U1.1 ; 32.3,11.99 32.33,11.96 32.33,2.46
  Top Layer w3: P5.1 43.51,10.04 41.57,11.99 28.51,11.99 P2.24
  Bottom Layer w1.5: v2(12.5,46.31) 12.5,49.11 v2(8.92,52.68)
  vias: v2(8.31,52.78)
12V-SW: length 59.7
  Top Layer w0.3: v2(33.51,15.5) 33.51,24.48 52.03,43 U5.2
  Top Layer w1: D7.2 24.63,8.06 24.33,7.75 P7.2
  Bottom Layer w0.3: v2(33.51,15.5) 24.33,6.32 P7.2
12V_2: length 25.4
  Top Layer w1.5: 57.73,22.59 57.73,25.25 56.61,26.37 C51.1 47.23,26.37 42.18,21.32 D27.2
12V_DIV: length 50.5
  Top Layer w1.5: H8.8 14.15,64.84 C22.1 11.63,62.67 11.47,62.82 ; 11.47,62.82 11.47,76.71 14.27,79.5 C18.1 14.15,81.67 H5.8 ; 11.47,62.82 11.47,51.34 14.43,48.39 U1.3
GND: length 43.2
  Top Layer w0.3: v2(59.37,11.17) 60.13,11.17 60.9,10.4 D22.2 ; v2(69.97,11.99) 71.45,11.99 71.86,11.58 D18.2 71.86,10 v2(71.96,9.89) ; v2(83.18,22.8) 83.18,24.33 82.77,24.74 U17.2
  Top Layer w0.4: v2(113.98,70.22) 114.43,69.77 U9.15 ; U8.13 107.84,66.42 v2(108.67,67.26) ; C34.2 119.54,45.39 119.54,47.27 v2(120.46,48.19) 120.75,48.48 125.95,48.48 v2(126.78,49.31) ; U4.3 119.09,35.92 R13.2 120.47,38.7 v2(120.61,38.7) ; v2(111.29,73.51) 111.26,73.48 105.4,73.48 v2(105.36,73.43)
  Bottom Layer w0.3: v2(83.18,22.8) 82.67,22.29 v2(82.01,22.29) ; v2(59.37,11.17) 59.21,11.02 v2(59.21,10.56)
  Bottom Layer w0.4: v2(108.67,67.26) 111.02,67.26 v2(113.98,70.22) ; v2(105.36,73.43) v2(103.78,73.43)
  vias: v2(0.82,43.98) v2(0.98,51.68) v2(0.97,50.25) v2(0.92,42.55) v2(1.08,49.18) v2(1.03,39.6) v2(1.18,47.76) v2(1.21,41.33) v2(1.47,46.53) v2(1.48,45.21) v2(1.54,38.83) v2(1.74,94.17) v2(1.74,50.41) v2(1.77,43.98) v2(1.8,28.38) v2(1.8,20.67) v2(1.87,42.55) v2(1.91,37.81) v2(1.94,51.68) v2(1.98,39.6) v2(2.03,49.18) v2(2.13,47.76) v2(2.16,41.33) v2(2.25,93.4) v2(2.3,27.61) v2(2.3,19.91) v2(2.42,46.53) v2(2.44,45.21) v2(2.49,38.83) v2(2.7,94.17) v2(2.69,50.41) v2(2.72,43.98) v2(2.75,28.38) v2(2.75,20.67) v2(2.83,48.72) v2(2.83,42.55) v2(2.97,51.68) v2(2.93,47.3) v2(2.97,40.87) v2(3.21,93.4) v2(3.22,46.07) v2(3.24,44.75) v2(3.26,27.61) v2(3.26,19.91) v2(3.5,49.95) v2(3.44,35.36) v2(3.53,43.52) v2(3.6,39.9) v2(3.65,94.17) v2(3.63,42.09) v2(3.68,38.32) v2(3.7,28.38) v2(3.7,20.67) v2(3.78,48.72) v2(3.82,50.71) v2(3.89,47.3) v2(3.92,51.68) v2(3.97,37.1) v2(4.11,39.14) v2(4.19,44.75) v2(4.45,49.95) v2(4.55,39.9) v2(4.65,46.07) v2(4.65,41.07) v2(4.63,38.32) v2(4.69,35.31) v2(4.94,93.17) v2(4.96,51.68) v2(4.92,37.1) v2(5.11,50.61) v2(5.06,39.14) v2(5.21,48.72) v2(5.21,43.73) v2(5.31,47.3) v2(5.31,42.3) v2(5.45,92.4) v2(5.6,46.07) v2(5.6,41.07) v2(5.57,39.95) v2(5.59,38.32) v2(5.9,93.17) v2(5.91,51.68) v2(5.88,49.95) v2(5.88,44.95) v2(5.88,37.1) v2(5.96,35.41) v2(6.08,39.19) v2(6.19,50.81) v2(6.16,48.72) v2(6.16,43.73) v2(6.27,47.3) v2(6.27,42.3) v2(6.41,92.4) v2(6.39,20.62) v2(6.55,46.07) v2(6.55,41.07) v2(6.52,39.95) v2(6.54,38.32) v2(6.85,93.17) v2(6.85,51.68) v2(6.83,49.95) v2(6.83,44.95) v2(6.89,19.86) v2(7.12,48.72) v2(7.12,43.73) v2(7.03,39.19) v2(7.2,50.76) v2(7.22,47.3) v2(7.22,42.3) v2(7.34,20.62) v2(7.51,46.07) v2(7.51,41.07) v2(7.61,37.86) v2(7.78,49.95) v2(7.78,44.95) v2(7.85,19.86) v2(8.07,48.72) v2(8.07,43.73) v2(8.17,47.3) v2(8.17,42.3) v2(8.17,39.85) v2(8.25,50.74) v2(8.29,20.62) v2(8.56,46.12) v2(8.68,41.27) v2(8.63,33.37) v2(8.73,49.95) v2(8.73,44.95) v2(8.84,47.8) v2(9.02,48.82) v2(9.04,43.62) v2(9.08,34.13) v2(9.14,46.99) v2(9.3,42.55) v2(9.24,37.61) v2(9.6,46.28) v2(9.58,33.37) v2(9.7,44.85) v2(9.64,41.27) v2(9.99,43.62) v2(10.25,42.55) v2(10.41,27.81) v2(10.92,27.05) v2(11.37,27.81) v2(11.43,20.37) v2(11.88,27.05) v2(11.94,19.6) v2(12.32,27.81) v2(12.39,20.37) v2(12.9,19.6) v2(13.34,20.37) v2(13.83,11.65) v2(14.19,14.86) v2(14.34,10.88) v2(14.7,14.1) v2(14.78,11.65) v2(15.11,89.31) v2(15.14,14.86) v2(15.29,10.88) v2(15.65,14.1) v2(15.73,11.65) v2(16.09,14.86) v2(16.99,105.74) v2(17.5,104.98) v2(17.82,89.36) v2(17.95,105.74) v2(18.46,104.98) v2(18.42,56.53) v2(18.9,105.74) v2(18.94,89.62) v2(19.37,56.53) v2(20.42,90.13) v2(20.33,56.53) v2(21.28,56.53) v2(21.49,90.02) v2(21.53,106.97) v2(21.83,18.36) v2(22.04,106.2) v2(22.48,106.97) v2(22.99,106.2) v2(23.44,106.97) v2(24.03,10.58) v2(24.47,11.34) v2(24.98,10.58) v2(28.1,18.87) v2(28.21,7.82) v2(28.28,50) v2(28.49,56.83) v2(28.67,90.24) v2(28.72,50.76) v2(28.93,57.6) v2(29.18,89.47) v2(29.23,50) v2(29.35,7.82) v2(29.44,56.83) v2(29.62,90.24) v2(30.27,58.77) v2(30.7,90.9) v2(30.71,59.54) v2(31.21,90.14) v2(31.22,58.77) v2(31.31,20.15) v2(31.47,79.03) v2(31.65,90.9) v2(31.73,79.89) v2(31.9,60.4) v2(32.14,96.77) v2(32.34,61.17) v2(32.49,79.13) v2(32.65,96) v2(32.85,60.4) v2(33.09,96.77) v2(33.6,96) v2(33.77,99.37) v2(34.04,96.77) v2(34.28,98.6) v2(34.38,46.23) v2(34.72,99.37) v2(34.89,45.46) v2(34.83,22.8) v2(35.19,28.05) v2(35.23,98.6) v2(35.4,50.41) v2(35.34,46.23) v2(35.68,99.37) v2(35.91,49.64) v2(35.85,45.46) v2(36.01,22.24) v2(36.06,23.66) v2(36.29,46.23) v2(36.36,50.41) v2(36.87,49.64) v2(37.31,50.41) v2(37.64,24.79) v2(40.57,106.34) v2(40.66,86.67) v2(41.01,89.42) v2(41.08,105.57) v2(41.17,85.9) v2(41.52,106.34) v2(41.52,88.66) v2(41.61,86.67) v2(41.63,99.16) v2(41.97,89.42) v2(42.03,105.57) v2(42.14,98.4) v2(42.48,106.34) v2(42.58,99.16) v2(43.09,98.4) v2(43.53,99.16) v2(46.31,38.96) v2(46.56,35.85) v2(48.21,2.31) v2(48.19,1.52) v2(48.65,41.62) v2(49.22,37.84) v2(49.16,2.31) v2(49.14,1.52) v2(49.48,11.34) v2(49.46,10.55) v2(49.58,13.08) v2(49.57,12.29) v2(50.42,10.55) v2(50.52,12.29) v2(50.43,11.34) v2(50.43,8.77) v2(50.53,13.08) v2(50.65,7.47) v2(50.64,6.67) v2(50.91,5.2) v2(50.89,4.41) v2(50.91,3.31) v2(50.89,2.52) v2(51.4,10.88) v2(51.39,8.77) v2(51.61,7.47) v2(51.59,6.67) v2(51.92,44.37) v2(51.86,5.2) v2(51.85,4.41) v2(51.86,3.31) v2(51.85,2.52) v2(52.59,5.99) v2(52.94,41.31) v2(56.81,1.68) v2(56.82,2.47) v2(57.78,2.47) v2(57.76,1.68) v2(58.75,42.99) v2(58.8,38.84) v2(58.8,37.89) v2(58.8,36.94) v2(58.85,11.63) v2(58.96,12.34) v2(59.39,41.13) v2(59.38,35.92) v2(59.38,2.82) v2(59.36,2.03) v2(59.56,39.31) v2(59.56,38.35) v2(59.56,37.4) v2(60.14,36.07) v2(60.31,2.03) v2(60.34,34.95) v2(60.33,2.82) v2(60.48,71.56) v2(60.47,38.69) v2(60.47,37.74) v2(60.47,36.79) v2(60.64,44.01) v2(60.63,41.23) v2(60.81,39.91) v2(60.99,70.79) v2(61.32,36.03) v2(61.32,35.08) v2(61.32,34.13) v2(61.43,71.56) v2(61.52,39.9) v2(61.42,38.84) v2(61.42,37.89) v2(61.42,36.94) v2(61.62,2.98) v2(61.6,2.19) v2(61.7,25.7) v2(61.81,32.81) v2(61.72,26.49) v2(61.94,70.79) v2(62.15,34.4) v2(62.28,43.37) v2(62.38,71.56) v2(62.33,40.97) v2(62.47,39.9) v2(62.57,2.98) v2(62.55,2.19) v2(62.67,26.49) v2(62.66,25.7) v2(62.8,41.89) v2(62.76,32.81) v2(62.89,70.79) v2(62.84,16.95) v2(62.83,16.16) v2(63.11,34.4) v2(63.27,24.05) v2(63.25,23.26) v2(63.34,71.56) v2(63.39,44.19) v2(63.52,42.63) v2(63.42,39.9) v2(63.61,33.43) v2(63.61,25.7) v2(63.62,26.49) v2(63.79,16.95) v2(63.78,16.16) v2(63.73,14.27) v2(63.85,70.79) v2(64.06,34.4) v2(64.12,2.98) v2(64.1,2.19) v2(64.22,24.05) v2(64.2,23.26) v2(64.61,43.93) v2(64.57,33.43) v2(64.68,17.05) v2(64.66,16.26) v2(64.75,40.16) v2(64.88,20.47) v2(64.87,19.68) v2(65.02,21.36) v2(65.04,22.15) v2(65.07,2.98) v2(65.05,2.19) v2(65.14,25.83) v2(65.12,25.04) v2(65.17,24.05) v2(65.15,23.26) v2(65.26,34.24) v2(65.27,18.79) v2(65.52,33.43) v2(65.72,43.98) v2(65.82,19.68) v2(65.89,40.11) v2(65.9,23.94) v2(65.89,23.15) v2(65.84,20.47) v2(65.91,7.8) v2(65.9,7.01) v2(65.99,22.15) v2(65.97,21.36) v2(66.09,25.83) v2(66.07,25.04) v2(66.8,19.83) v2(66.85,23.94) v2(66.84,23.15) v2(66.82,20.62) v2(66.86,7.8) v2(66.85,7.01) v2(66.97,43.88) v2(66.94,22.15) v2(66.92,21.36) v2(67.77,20.62) v2(67.76,19.83) v2(67.99,22.31) v2(67.98,21.52) v2(68.04,43.01) v2(68.39,11.07) v2(68.4,8.03) v2(68.39,7.24) v2(68.49,11.88) v2(68.61,5.94) v2(68.59,5.14) v2(68.64,43.62) v2(68.97,51.73) v2(68.97,50.77) v2(68.97,49.82) v2(68.97,48.87) v2(68.95,22.31) v2(68.93,21.52) v2(69.03,42.71) v2(69.24,25.28) v2(69.23,24.49) v2(69.26,11.99) v2(69.26,11.22) v2(69.35,8.03) v2(69.34,7.24) v2(69.58,51.16) v2(69.58,50.21) v2(69.58,49.26) v2(69.59,43.62) v2(69.56,5.94) v2(69.54,5.14) v2(70.2,25.28) v2(70.18,24.49) v2(70.54,43.62) v2(70.79,28.06) v2(70.89,30.04) v2(70.89,26.63) v2(71.51,43.68) v2(71.45,29.28) v2(71.74,28.06) v2(71.84,26.63) v2(72.07,105.51) v2(72.4,29.28) v2(72.69,28.06) v2(72.86,106.62) v2(73.23,105.51) v2(73.35,29.28) v2(73.64,28.06) v2(74.07,106.62) v2(74.3,29.28) v2(74.38,105.51) v2(75.03,70.4) v2(75.22,2.75) v2(75.24,44.24) v2(75.24,3.54) v2(75.53,105.51) v2(75.54,69.64) v2(75.75,43.47) v2(75.92,29.84) v2(75.98,70.4) v2(76.19,44.24) v2(76.19,3.54) v2(76.17,2.75) v2(76.49,69.64) v2(76.68,105.51) v2(76.7,43.47) v2(76.85,106.72) v2(76.93,102.5) v2(76.94,70.4) v2(77.14,44.24) v2(77.45,69.64) v2(77.48,30.04) v2(77.53,104.29) v2(77.65,43.47) v2(77.84,105.51) v2(77.89,70.4) v2(78.08,102.5) v2(78.09,44.24) v2(78.04,36.04) v2(78.18,37.15) v2(78.28,34.75) v2(78.4,69.64) v2(78.6,43.47) v2(78.68,104.29) v2(78.91,3.49) v2(78.89,2.7) v2(78.99,105.51) v2(78.99,36.04) v2(79.04,33.99) v2(79.13,37.15) v2(79.23,102.5) v2(79.23,34.75) v2(79.84,104.29) v2(79.86,3.49) v2(79.84,2.7) v2(79.94,36.04) v2(80,33.99) v2(80.08,37.15) v2(80.14,105.51) v2(80.18,34.75) v2(80.38,102.5) v2(80.85,35.46) v2(80.9,7.16) v2(80.88,6.37) v2(80.99,104.29) v2(80.95,33.99) v2(81.54,102.5) v2(81.65,35.31) v2(81.85,7.16) v2(81.83,6.37) v2(82.14,104.29) v2(82.38,105.51) v2(82.49,38.16) v2(82.5,35.87) v2(82.69,102.5) v2(82.72,22.19) v2(83.21,37.05) v2(83.29,104.29) v2(83.44,38.16) v2(83.53,105.51) v2(83.54,22.13) v2(83.8,98.96) v2(83.84,102.5) v2(83.95,22.7) v2(84.11,96.97) v2(84.25,99.73) v2(84.44,104.29) v2(84.62,96.21) v2(84.57,7.06) v2(84.55,6.27) v2(84.68,105.51) v2(84.76,98.96) v2(84.81,22.64) v2(84.99,102.5) v2(85.06,96.97) v2(85.2,99.73) v2(85.5,6.27) v2(85.6,104.29) v2(85.57,96.21) v2(85.52,7.06) v2(85.83,105.51) v2(86.01,96.97) v2(86.01,70.26) v2(86.03,99.32) v2(86.2,4.66) v2(86.19,3.87) v2(86.32,98.09) v2(86.52,69.49) v2(86.75,34.7) v2(86.8,33.53) v2(86.91,84.63) v2(86.91,2.62) v2(86.9,1.83) v2(86.98,105.51) v2(86.98,99.32) v2(86.97,70.26) v2(87.15,4.66) v2(87.14,3.87) v2(87.27,98.09) v2(87.43,83.86) v2(87.48,69.49) v2(87.54,35.31) v2(87.54,34.14) v2(87.68,97.28) v2(87.88,93.81) v2(87.87,84.63) v2(87.88,81.57) v2(87.92,70.26) v2(87.87,2.62) v2(87.85,1.83) v2(87.94,99.32) v2(88.19,96.51) v2(88.39,93.04) v2(88.38,83.86) v2(88.39,80.8) v2(88.4,44.96) v2(88.4,44.01) v2(88.39,34.5) v2(88.43,69.49) v2(88.61,45.86) v2(88.69,33.05) v2(88.82,84.63) v2(88.84,93.81) v2(88.84,81.57) v2(88.87,70.26) v2(89.09,28.91) v2(89.35,93.04) v2(89.33,83.86) v2(89.35,80.8) v2(89.38,69.49) v2(89.35,31.69) v2(89.57,46.48) v2(89.79,93.81) v2(89.77,84.63) v2(89.79,81.57) v2(90.3,93.04) v2(90.28,83.86) v2(90.3,80.8) v2(90.42,29.27) v2(90.74,93.81) v2(90.74,81.57) v2(90.72,46.63) v2(91.25,93.04) v2(91.25,80.8) v2(91.81,2.88) v2(91.79,2.08) v2(91.83,46.68) v2(92.03,45.82) v2(92.76,2.88) v2(92.75,2.08) v2(93.44,8.59) v2(93.43,7.8) v2(94.4,8.59) v2(94.38,7.8) v2(95.07,3.69) v2(95.06,2.9) v2(96.01,2.9) v2(96.03,3.69) v2(96.25,10.42) v2(96.23,9.63) v2(96.61,7.26) v2(96.59,6.47) v2(96.94,28.76) v2(97.01,17.05) v2(97,16.26) v2(97.22,22.51) v2(97.2,21.72) v2(97.2,10.42) v2(97.18,9.63) v2(97.51,46.74) v2(97.56,7.26) v2(97.54,6.47) v2(97.97,17.05) v2(97.95,16.26) v2(98.17,22.51) v2(98.15,21.72) v2(98.46,46.74) v2(99.02,63.41) v2(99.07,69.99) v2(99.41,46.74) v2(99.73,69.28) v2(99.89,63) v2(100.04,70.04) v2(100.52,23.3) v2(100.48,21.64) v2(100.47,20.85) v2(100.52,18.05) v2(100.58,107.55) v2(100.53,24.09) v2(100.53,18.84) v2(101.11,69.89) v2(101.23,41.1) v2(101.74,107.55) v2(101.84,30.54) v2(101.93,69.43) v2(102.48,67.17) v2(102.48,66.21) v2(102.48,65.26) v2(102.48,64.31) v2(102.61,17.54) v2(102.63,72.89) v2(102.63,71.94) v2(102.63,70.99) v2(102.71,23.35) v2(102.67,21.39) v2(102.66,20.6) v2(102.62,18.33) v2(102.73,24.14) v2(102.86,73.91) v2(102.88,69.43) v2(102.91,7.69) v2(102.98,11.55) v2(102.96,10.76) v2(102.93,8.49) v2(103.49,5.78) v2(103.47,4.99) v2(103.52,41.2) v2(103.66,74.58) v2(103.7,66.5) v2(103.7,65.55) v2(103.7,64.6) v2(103.7,63.65) v2(103.85,72.23) v2(103.85,71.28) v2(103.85,70.32) v2(103.85,69.37) v2(103.92,10.76) v2(103.88,8.49) v2(103.87,7.69) v2(103.93,11.55) v2(104.19,33.96) v2(104.29,45.59) v2(104.44,5.78) v2(104.43,4.99) v2(105.39,66.47) v2(106.43,69.48) v2(107.01,44.55) v2(107.4,69.5) v2(107.91,5.35) v2(107.93,6.14) v2(108.09,49.99) v2(108.09,49.04) v2(108.09,48.09) v2(108.11,46.76) v2(108.08,8.43) v2(108.06,7.64) v2(108.42,62.89) v2(108.6,41.28) v2(108.54,11.6) v2(108.52,10.81) v2(108.73,64.02) v2(108.88,6.14) v2(108.86,5.35) v2(108.96,69.32) v2(108.94,68.25) v2(109.01,62.41) v2(109.02,7.64) v2(109.05,18.58) v2(109.03,17.79) v2(109.03,8.43) v2(109.49,11.6) v2(109.47,10.81) v2(109.63,66.06) v2(109.75,32.33) v2(109.81,22.31) v2(109.8,21.52) v2(109.83,71.32) v2(109.97,62.41) v2(110,18.58) v2(109.98,17.79) v2(110.24,73.51) v2(110.36,32.84) v2(110.77,36.82) v2(110.77,22.31) v2(110.75,21.52) v2(110.87,35.29) v2(111.38,71) v2(111.4,68.71) v2(111.41,66.72) v2(111.43,69.78) v2(111.45,67.54) v2(112.91,44.92) v2(113.03,68.97) v2(113.11,17.95) v2(113.18,69.83) v2(113.21,31.1) v2(113.13,18.74) v2(113.65,52.29) v2(113.65,51.33) v2(113.65,50.38) v2(113.89,8.54) v2(113.88,7.75) v2(114.03,38.8) v2(114.08,18.74) v2(114.07,17.95) v2(114.2,11.6) v2(114.18,10.81) v2(114.85,8.54) v2(114.83,7.75) v2(115,69.83) v2(115.15,11.6) v2(115.14,10.81) v2(115.69,31) v2(115.95,33.6) v2(116.28,32.53) v2(116.73,34.98) v2(116.84,31) v2(117.01,65.91) v2(117.04,69.18) v2(117.21,68.26) v2(117.16,63.51) v2(117.57,60.86) v2(117.67,67.14) v2(117.87,69.48) v2(117.82,64.74) v2(117.96,65.91) v2(118.11,63.51) v2(118.16,68.26) v2(118.23,62.09) v2(118.28,45.54) v2(118.4,92.38) v2(118.4,46.67) v2(118.52,60.86) v2(118.62,67.14) v2(118.77,64.74) v2(118.82,69.48) v2(118.91,65.91) v2(119.11,68.26) v2(119.06,63.51) v2(119.18,62.09) v2(119.47,60.86) v2(119.57,67.14) v2(119.61,18.79) v2(119.59,18) v2(119.78,69.48) v2(119.73,64.74) v2(119.76,2.62) v2(119.74,1.83) v2(119.88,91.31) v2(119.86,65.91) v2(119.84,59.38) v2(119.98,92.18) v2(120.01,63.51) v2(120.07,68.26) v2(120.13,62.09) v2(120.42,60.86) v2(120.52,67.14) v2(120.56,18.79) v2(120.54,18) v2(120.68,64.74) v2(120.68,46.81) v2(120.71,2.62) v2(120.7,1.83) v2(120.73,69.48) v2(120.8,59.38) v2(120.76,45.33) v2(121.09,62.09) v2(121.49,63.74) v2(121.75,59.38) v2(122.09,67.85) v2(122.11,65.66) v2(122.24,60.96) v2(122.36,62.11) v2(122.34,17.03) v2(122.58,91.41) v2(122.7,68.92) v2(122.77,66.88) v2(122.88,92.18) v2(123.09,92.89) v2(123.04,67.85) v2(123.06,65.66) v2(123.07,63.46) v2(123.14,94.42) v2(123.19,60.96) v2(123.49,17.03) v2(123.65,68.92) v2(123.72,66.88) v2(123.64,62.01) v2(123.74,64.69) v2(123.99,67.85) v2(124.01,65.66) v2(124.03,63.46) v2(124.13,94.41) v2(124.15,60.96) v2(124.3,19.12) v2(124.35,30.34) v2(124.49,31.1) v2(124.6,68.92) v2(124.67,66.88) v2(124.69,64.69) v2(124.64,17.95) v2(124.96,65.66) v2(124.98,63.46) v2(125.14,37.84) v2(125.49,32.58) v2(125.5,30.34) v2(125.51,19.58) v2(125.62,66.88) v2(125.64,64.69) v2(125.76,68.21) v2(125.88,57.01) v2(125.93,63.46) v2(126.18,37.89) v2(126.24,69.31) v2(126.36,97.48) v2(126.34,57.98) v2(126.37,29.17) v2(126.59,64.69) v2(126.59,18.46) v2(126.71,68.21) v2(126.65,30.34) v2(126.76,87.03) v2(126.95,38.55) v2(127,28.35) v2(127.31,66.96) v2(127.26,65.89) v2(127.26,57.19) v2(127.36,69.31) v2(127.42,39.42) v2(127.38,18.86) v2(127.51,97.48) v2(127.57,64.82) v2(127.57,50.13) v2(127.66,68.21) v2(127.92,87.03) v2(127.92,58.41) v2(128.06,47.93) v2(128.21,57.19) v2(128.21,38.35) v2(128.57,39.42) v2(128.66,97.48) v2(128.84,59.79) v2(128.87,58.41) v2(128.99,19.02) v2(129.07,87.03) v2(129.16,57.19) v2(129.5,61.02) v2(129.47,20.5) v2(129.66,88.25) v2(129.81,97.48) v2(129.79,59.79) v2(129.72,39.42) v2(129.82,58.41) v2(130.11,57.19) v2(130.14,19.02) v2(130.22,87.03) v2(130.45,61.02) v2(130.71,85.65) v2(130.74,59.79) v2(130.78,58.41) v2(130.88,62.37) v2(130.97,97.48) v2(130.98,29.17) v2(131.03,50.44) v2(131.3,88.1) v2(131.29,57.37) v2(131.29,19.02) v2(131.37,87.03) v2(131.4,61.02) v2(131.56,76.62) v2(131.69,59.79) v2(131.73,73.61) v2(131.75,52.37) v2(131.9,56.56) v2(131.95,63.54) v2(132.01,58.68) v2(131.95,51) v2(132.11,69.66) v2(132.11,68.39) v2(132.11,67.11) v2(132.05,65.84) v2(132.2,96.56) v2(132.16,64.66) v2(132.13,29.17) v2(132.29,85.7) v2(132.31,62.32) v2(132.36,61.02) v2(132.51,76.62) v2(132.46,57.58) v2(132.45,19.02) v2(132.53,87.03) v2(132.68,73.61) v2(132.72,50.21) v2(132.87,52.58) v2(132.92,51.46) v2(133.15,95.9) v2(133.15,94.75) v2(133.15,93.6) v2(133.15,92.44) v2(133.15,91.29) v2(133.15,90.14) v2(133.15,88.99) v2(133.15,87.83) v2(133.21,84.55) v2(133.21,83.4) v2(133.21,82.24) v2(133.21,81.09) v2(133.21,79.94) v2(133.21,78.79) v2(133.21,77.63) v2(133.18,39.42) v2(133.27,75.14) v2(133.28,29.17) v2(133.36,76.57)
VIN_12V: length 50.3
  Top Layer w0.3: 55.9,34.68 56,34.78 R14.1
  Top Layer w1.5: 38.81,16.79 38.81,22.49 51,34.68 57.83,34.68 62.58,29.93 C2.1 68.39,30.39 68.39,34.88
(no net):
  vias: v1(59.64,21.58) v1(59.64,20.96) v1(59.64,20.34) v1(59.64,19.72) v1(59.64,19.1) v1(60.28,21.58) v1(60.28,20.96) v1(60.28,20.34) v1(60.28,19.72) v1(60.28,19.1) v1(60.91,21.58) v1(60.91,20.96) v1(60.91,20.34) v1(60.91,19.72) v1(60.91,19.1) v1(61.55,21.58) v1(61.55,20.96) v1(61.55,20.34) v1(61.55,19.72) v1(61.55,19.1) v1(64.54,38.54) v1(64.54,37.92) v1(64.54,37.3) v1(64.54,36.68) v1(64.54,36.06) v1(65.17,38.54) v1(65.17,37.92) v1(65.17,37.3) v1(65.17,36.68) v1(65.17,36.06) v1(65.81,38.54) v1(65.81,37.92) v1(65.81,37.3) v1(65.81,36.68) v1(65.81,36.06) v1(66.45,38.54) v1(66.45,37.92) v1(66.45,37.3) v1(66.45,36.68) v1(66.45,36.06)
2_EN_O: length 153
  Top Layer w0.4: H7.8 15.44,54.62 23.21,54.62 33.25,64.67 v2(33.25,67.53) ; v2(66.86,69.36) 69.03,71.53 100.99,71.53
  Bottom Layer w0.4: v2(66.86,69.36) 66,68.49 34.27,68.49 ; 34.27,68.49 34.22,68.55 34.22,83.74 32.79,85.17 16.16,85.17 H2.8 ; 34.27,68.49 33.3,67.53 16.89,67.53 H4.8
A_1A: length 33.5
  Top Layer w0.6: H3.4 25.08,99.21 R20.1
  Bottom Layer w1: H3.4 24.31,98.96 17.96,92.61 14.14,92.61 5.28,83.76 P8.3
A_1B: length 36.7
  Top Layer w0.6: R22.1 26.85,95.74 H3.3
  Bottom Layer w1: 2.64,81.37 2.8,81.37 ; P8.4 4.88,81.22 14.85,91.18 18.5,91.18 26.85,99.54 H3.3
A_2A: length 30.2
  Top Layer w0.6: R19.1 23.17,98.58 H3.5
  Bottom Layer w1: P8.2 5.58,86.3 13.27,93.99 16.84,93.99 21.77,98.92 H3.5
A_2B: length 26.8
  Top Layer w0.6: R18.1 21.27,97.94 H3.6
  Bottom Layer w1: H3.6 19.23,98.98 15.61,95.36 12.4,95.36 5.87,88.84 P8.1
A_DIR_O: length 74.2
  Top Layer w0.4: 100.99,74.78 46.35,74.78 33.95,87.17 H2.1
A_STEP_O: length 77.8
  Top Layer w0.4: 100.99,75.43 47.44,75.43 34.27,88.59 30.55,88.59 29.39,87.43 H2.2
B_1A: length 31.9
  Top Layer w0.6: H5.4 24.91,82.47 24.91,79.1
  Bottom Layer w1: P10.3 7.45,70.57 12.25,75.37 18.42,75.37 24.31,81.27 H5.4
B_1B: length 35.5
  Top Layer w0.6: 26.78,79.1 26.85,79.18 H5.3
  Bottom Layer w1: H5.3 26.85,80.95 19.24,73.33 13.93,73.33 8.63,68.03 P10.4
B_2A: length 27.6
  Top Layer w0.6: 23.04,79.1 23.04,81.8 H5.5
  Bottom Layer w1: H5.5 16.03,77.31 10.36,77.31 6.16,73.11 P10.2
B_2B: length 24.3
  Top Layer w0.6: H5.6 21.17,81.13 21.17,79.1
  Bottom Layer w1: H5.6 15.07,78.89 8.88,78.89 5.64,75.65 P10.1
B_DIR_O: length 70.4
  Top Layer w0.4: H4.1 57.51,70.26 60.73,73.48 100.99,73.48
B_STEP_O: length 73.2
  Top Layer w0.4: 100.99,74.13 59.08,74.13 56.92,71.96 31.1,71.96 H4.2
C_1A: length 30.9
  Top Layer w0.6: H8.4 24.94,65.67 R38.1
  Bottom Layer w1: H8.4 24.31,63.21 22.4,61.3 17.5,61.3 13.59,57.39 P14.3
C_1B: length 34.2
  Top Layer w0.6: R39.1 26.92,66.23 H8.3
  Bottom Layer w1: H8.3 26.85,63.61 23.11,59.87 18.11,59.87 13.09,54.85 P14.4 ; 2.78,54.97 2.88,54.87
C_2A: length 26.9
  Top Layer w0.6: R37.1 22.95,65.12 H8.5
  Bottom Layer w1: P14.2 13.48,59.93 16.28,62.72 20.15,62.72 21.77,64.35 H8.5
C_2B: length 23.1
  Top Layer w0.6: R36.1 20.96,64.57 H8.6
  Bottom Layer w1: P14.1 13.57,62.47 15.31,64.2 18.37,64.2 19.23,65.07 H8.6
C_DIR_O: length 76.9
  Top Layer w0.4: 100.99,72.18 68.15,72.18 49.31,53.34 H7.1
C_STEP_O: length 79.7
  Top Layer w0.4: 100.99,72.83 67.57,72.83 50.18,55.44 31.49,55.44 H7.2
D1+: length 4.8
  Top Layer w0.3: 61.79,5.94 61.02,6.72 61.02,8.69 61.84,9.52 D22.3
D1-: length 4.7
  Top Layer w0.3: 59.79,5.94 60.57,6.72 60.57,8.74 59.94,9.37 D22.1
DM: length 3.5
  Top Layer w0.3: U18.9 71.39,15.13 71.66,14.87 71.66,14.38 70.91,13.64 D18.6
DM1: length 18.1
  Top Layer w0.3: D22.6 59.94,12.07 60.59,11.42 62.73,11.42 72.66,21.36 U18.7
DM4: length 3.2
  Top Layer w0.3: U18.1 80.28,23.37 80.7,23.79 U17.3
DP: length 3.5
  Top Layer w0.3: U18.10 72.66,15.24 72.25,14.83 72.25,14.24 72.81,13.69 D18.4
DP1: length 14.3
  Top Layer w0.3: U18.8 71.39,20.73 63.04,12.37 D22.4
DP4: length 5.1
  Top Layer w0.3: U17.1 81.68,25.69 79.01,23.01 U18.2
ESP_BOOT: length 34.6
  Top Layer w0.4: K2.2 111.37,38.75 v2(108.16,38.75) ; Q1.3 99.09,38.29 v2(100.16,38.29) ; v2(109.75,41.35) 111.12,42.73 111.12,44.57 113.21,46.66 113.21,47.93 115.43,50.15 U9.25
  Bottom Layer w0.4: v2(109.75,41.35) 108.16,39.77 v2(108.16,38.75) 107.71,38.29 v2(100.16,38.29)
ESP_RST: length 60.7
  Top Layer w0.4: R35.2 104.83,36.43 Q2.3 106.03,35.89 106.58,35.34 106.58,34.17 R28.1 108.75,34.09 C23.2 108.82,34.16 v2(110.26,34.16) ; v2(114.74,34.42) 117.14,36.82 117.14,41.61 118.77,43.24 121.07,43.24 v2(122.5,44.67) ; v2(124.43,59.26) 129.4,64.23 U9.3
  Bottom Layer w0.4: v2(114.74,34.42) 114.49,34.16 v2(110.26,34.16) ; v2(124.43,59.26) 124.43,56.3 125.5,55.23 125.5,47.68 v2(122.5,44.67)
I2S_BCK: length 24.9
  Top Layer w0.4: U9.12 117.97,73.37 117.44,73.9 114.18,73.9 112.45,72.18 110.49,72.18 ; 106.64,65.12 109.6,65.12 109.61,65.11 R16.1 110.56,72.11 110.49,72.18 ; 110.49,72.18 106.72,72.18
I2S_DATA: length 17
  Top Layer w0.4: U9.10 120.51,73.74 119.02,75.23 113.57,75.23 112.47,74.13 106.72,74.13
I2S_MR#: length 16.7
  Top Layer w0.4: 106.64,64.47 105.32,64.47 v2(105.31,64.46) 105.31,63.34 106.62,62.02 C17.2 106.59,60.59 R24.1 ; 106.72,71.53 v2(105.31,71.53)
  Bottom Layer w0.4: v2(105.31,64.46) 104.61,65.15 104.61,70.83 v2(105.31,71.53)
I2S_WS: length 25.5
  Top Layer w0.4: 106.72,72.83 112.24,72.83 113.92,74.51 118.46,74.51 119.24,73.73 U9.11 ; v2(108.57,71.34) 109.69,70.22 109.69,67.26 108.21,65.77 106.64,65.77
  Bottom Layer w0.4: v2(108.57,71.34) 108.11,71.8 v2(108.11,72.82)
I2SO(0): length 39.4
  Top Layer w0.4: H1.1 94.25,86.95 102.46,78.75 105.72,78.75 108.45,76.02 108.45,75.25 107.98,74.78 106.72,74.78
I2SO(8): length 18.8
  Top Layer w0.4: v2(105.36,67.62) 105.46,67.72 U8.15
  Bottom Layer w0.4: H9.4 96.73,62.27 106.03,62.27 107.5,63.74 107.5,66.52 106.4,67.62 v2(105.36,67.62)
IO2: length 38.7
  Top Layer w0.4: U7.2 78.89,60.02 v2(79.09,59.81) ; v2(110.26,57.72) 110.56,57.41 U9.24
  Bottom Layer w0.4: v2(79.09,59.81) 79.44,59.47 103.06,59.47 104.8,57.72 v2(110.26,57.72)
IO2_OUT: length 35
  Top Layer w0.4: U7.4 v2(68.19,60.97)
  Bottom Layer w0.4: v2(68.19,60.97) 41.42,60.97 39.83,59.37 P11.2
IO4: length 31
  Top Layer w0.4: R21.1 118.44,29.6 v2(119.33,30.49) ; U9.26 v2(116.7,51.66)
  Bottom Layer w0.4: v2(116.7,51.66) 116.7,45.52 119.33,42.88 v2(119.33,30.49)
IO4_OUT: length 15.3
  Top Layer w0.4: R23.1 120.1,25.11 R21.2 124.61,25.04 R17.2
  Top Layer w0.6: P9.2 124.8,23.1 D8.2 124.75,23.25 R17.2
IO12: length 46.9
  Top Layer w0.4: v2(82.47,86.65) U12.2 ; U9.14 v2(113.99,71.63)
  Bottom Layer w0.4: v2(113.99,71.63) 113.99,72.88 111.03,75.84 107.05,75.84 105.01,77.88 86.04,77.88 82.47,81.45 v2(82.47,86.65)
IO14: length 7.9
  Top Layer w0.4: R42.1 v2(112.86,76.14) ; U9.13 116.69,71.65 116.69,73.09 v2(116.59,73.19)
  Bottom Layer w0.4: v2(112.86,76.14) 115.82,73.19 v2(116.59,73.19)
IO14_IN: length 12.1
  Top Layer w0.6: R42.2 109.91,76.16 109.91,77.83 110.42,78.34 P17.1 107.88,80.22 R40.2 105.67,80.57 105.47,80.36
IO15: length 60.9
  Top Layer w0.4: v2(109.19,55.29) 107.05,53.14 100.22,53.14 98.07,51 98.07,49.73 v2(96.09,47.74) 89.1,47.74 86.28,44.92 R15.2 86.07,44.93 84.87,44.93 84.1,45.7 v2(82.21,45.7) ; v2(79.76,45.54) 79.76,45.54 U5.4 ; U9.23 112.59,58.68 v2(112.55,58.64)
  Bottom Layer w0.4: v2(112.55,58.64) v2(109.19,55.29) ; v2(79.76,45.54) 82.06,45.54 v2(82.21,45.7)
IO22: length 24.4
  Top Layer w0.4: v2(123.72,37.84) 123.21,37.33 R13.1 120.69,35.45 U4.2 ; v2(129.02,47.68) 129.4,48.06 U9.36
  Bottom Layer w0.4: v2(123.72,37.84) 123.72,42.37 v2(129.02,47.68)
IO32: length 7.6
  Top Layer w0.4: R29.1 124.18,78.75 123.05,77.63 U9.8
IO32_IN: length 12.1
  Top Layer w0.4: D9.2 126.27,81.81 C19.2 126.12,80.35 R29.2 124.13,80.46 R26.2
  Top Layer w0.6: D9.2 127.08,81.96 128.81,80.22 P12.1
IO33: length 10.7
  Top Layer w0.4: 115.26,77.54 118.82,77.54 121.78,74.57 U9.9
IO33_IN: length 11.5
  Top Layer w0.6: D13.2 115.15,83.35 R41.2 ; D13.2 115.67,79.19 R43.2 ; D13.2 116.02,82.83 118.63,80.22 P18.1
M_EN_O: length 90.7
  Top Layer w0.4: P2.6 P2.4 P2.2 39.37,42.28 65.47,68.37 U8.1
PROBE: length 20.7
  Top Layer w0.4: U9.7 124.32,73.9 v2(123.87,74.35) ; v2(120.56,85.42) 120.57,85.44 R34.2 120.57,88.21 119.87,88.92 U10.4
  Bottom Layer w0.4: v2(120.56,85.42) 121.78,84.2 121.78,76.44 v2(123.87,74.35)
PROBE_O: length 8.8
  Top Layer w0.6: P13.2 127,92.23 125.65,93.58 D10.2 124.75,92.93 U10.2
PWM: length 74.9
  Top Layer w0.3: 112.35,67.54 112.38,67.57 112.96,67.57
  Top Layer w0.4: v2(112.35,71.3) 112.35,61.35 109.44,58.44 106.53,58.44 104.34,56.25 102.04,56.25 101.33,55.53 U13.2 ; U14.2 74.87,86.7 v2(75.63,85.94) ; U9.16 112.96,67.57
  Bottom Layer w0.4: v2(112.35,71.3) 112.35,73.7 110.82,75.23 106.44,75.23 104.55,77.11 84.46,77.11 v2(75.63,85.94)
PWM_5V: length 25.4
  Top Layer w0.4: P20.1 56.86,104.38 65.15,96.09 74.72,96.09 75.82,94.98 U14.4
PWM_LAS: length 94.9
  Top Layer w0.4: U13.4 100.38,51.52 v2(99.37,50.51)
  Top Layer w0.6: P21.2 34.87,8.29 35.19,8.62 D30.2
  Bottom Layer w0.4: P21.2 34.87,5.8 38.71,9.64 53.65,9.64 62.07,18.05 67.73,18.05 99.37,49.69 v2(99.37,50.51)
R1IN: length 44.4
  Top Layer w0.6: v2(66.99,83.06) 66.96,83.02 U11.13
  Bottom Layer w0.6: v2(66.99,83.06) 47.12,102.92 36.52,102.92 34.64,104.8 P15.2
R1OUT: length 4.4
  Top Layer w0.4: U11.12 67.61,81.75 68.99,83.13 D11.1
R2IN: length 34.6
  Top Layer w0.4: U11.8 58.66,77.94 57.53,76.81 49.32,76.81 44.37,81.75 44.37,92.31 41.46,95.21 39.47,95.21
R2OUT: length 4.7
  Top Layer w0.4: R48.1 68.68,77.11 67.85,77.94 U11.9
RGB_OUT: length 12.8
  Top Layer w0.6: U4.4 119.66,33.11 120.51,33.96 131.34,33.96 131.5,33.8
RX2: length 5.8
  Top Layer w0.4: P22.2 131.37,44.12 125.75,44.12
RXD: length 108.2
  Top Layer w0.3: v2(83.33,58.44) 83.33,61.55 v2(83.07,61.81)
  Top Layer w0.4: 105.24,40.39 105.16,40.47 R51.1 107.18,41.73 D14.1 ; 105.24,40.39 113.37,40.39 114.95,41.97 114.95,46.66 118.06,49.77 124.43,49.77 126.86,52.2 U9.34 ; 105.24,40.39 96.94,40.39 v2(96.28,39.72) ; v2(86.85,39.42) 88.9,39.42 H6.2 90.83,35.55 D17.2 ; D11.2 73.44,83.23 v2(73.7,82.98)
  Bottom Layer w0.4: H6.2 93.06,39.72 v2(96.28,39.72) ; v2(83.07,61.81) 83.07,62.01 80.32,64.76 80.32,74.32 74.77,79.87 74.77,81.91 v2(73.7,82.98) ; v2(86.85,39.42) 86.85,40.66 83.73,43.77 83.73,58.04 v2(83.33,58.44)
RXD2: length 84.5
  Top Layer w0.4: v2(72.88,76.6) 72.37,77.11 R48.2 ; R58.1 122.55,45.71 v2(122.55,46.51) ; U9.27 118.01,54.59 v2(118.01,52.93) ; 88.69,62.73 v2(88.69,60.28)
  Bottom Layer w0.4: v2(122.55,46.51) 122.55,48.3 124.24,49.98 124.24,51.87 123.17,52.93 v2(118.01,52.93) 118.01,58.03 115.76,60.28 v2(88.69,60.28) 81.05,60.28 72.88,68.45 v2(72.88,76.6)
SD_CD: length 63.8
  Top Layer w0.4: 99.33,14.38 99.33,25.48 v2(99.95,26.11) 99.95,27.34 R60.1 ; U9.33 125.59,52.1 123.92,50.43 v2(123.16,50.43)
  Bottom Layer w0.4: v2(99.95,26.11) 118.57,26.11 121.68,29.22 121.68,48.95 v2(123.16,50.43)
SD_CS: length 46.7
  Top Layer w0.4: 107.03,14.38 107.03,26.11 107.41,26.49 R54.1 108.31,27.38 v2(108.47,27.53) ; v2(118.62,48.39) 116.53,46.3 116.53,37.89 109.8,31.15 v2(109.24,31.15) ; v2(120.05,51.45) 120.51,51.92 U9.29
  Bottom Layer w0.4: v2(109.24,31.15) 108.47,30.39 v2(108.47,27.53) ; v2(118.62,48.39) 118.62,50.03 v2(120.05,51.45)
SD_MISO: length 52.3
  Top Layer w0.4: v2(102.91,27.38) 101.91,27.38 R57.1 101.91,26.49 101.53,26.11 101.53,14.38 ; v2(113.11,41.35) 114.39,42.63 114.39,47.12 117.7,50.43 122.09,50.43 123.05,51.4 U9.31
  Bottom Layer w0.4: v2(113.11,41.35) 102.91,31.15 v2(102.91,27.38)
SD_MOSI: length 60.5
  Top Layer w0.4: R55.1 105.4,25.76 v2(105.82,25.34) 105.93,25.23 ; 105.93,25.31 105.93,25.23 ; 105.93,25.23 105.93,14.38 ; U9.37 130.67,51.67 v2(130.4,51.4)
  Bottom Layer w0.4: v2(105.82,25.34) 118.98,25.34 122.85,29.22 122.85,43.85 v2(130.4,51.4)
SD_SCLK: length 49.4
  Top Layer w0.4: v2(112.12,41.28) 113.83,42.99 113.83,47.34 117.99,51.5 v2(118.11,51.5) ; v2(121.48,52.12) 121.78,52.42 U9.30 ; 103.73,14.38 103.73,29.01 105.26,30.54 v2(105.26,34.47)
  Bottom Layer w0.4: v2(121.48,52.12) 118.72,52.12 v2(118.11,51.5) ; v2(105.26,34.47) 105.31,34.47 v2(112.12,41.28)
SW3_OUT: length 22.6
  Top Layer w0.4: P19.1 70.44,101.08 75.99,101.08 83.42,93.66 U12.4
T1IN: length 14.2
  Top Layer w0.4: D12.2 68.18,80.48 U11.11 ; v2(65.89,87.82) 65.19,88.52 R49.2
  Bottom Layer w0.4: v2(65.89,87.82) 67.98,85.73 v2(67.98,80.48)
T1OUT: length 42.3
  Top Layer w0.6: v2(63.5,84.56) 63.76,84.29 U11.14
  Bottom Layer w0.6: v2(63.5,84.56) 46.36,101.7 36.24,101.7 32.1,105.83 32.1,106.08
T2IN: length 4.3
  Top Layer w0.4: U11.10 69.52,79.21 R46.1
T2OUT: length 40.3
  Top Layer w0.4: U11.7 61.75,79.21 62.27,78.69 62.27,76.81 61.61,76.14 48.3,76.14 43.55,80.89 43.55,90.83 41.71,92.67 39.47,92.67
